# EasyEDA Pro project 通用采样.eprj

# Schematic NSM2015
Board Name: NSM2015; Create Date: 2025-08-12; Page Name: NSM2015; Project Name: 通用采样; Schematic Name: NSM2015; Update Date: 2025-08-15; Company: 嘉立创EDA; Page Size: A4; Version: V1.0
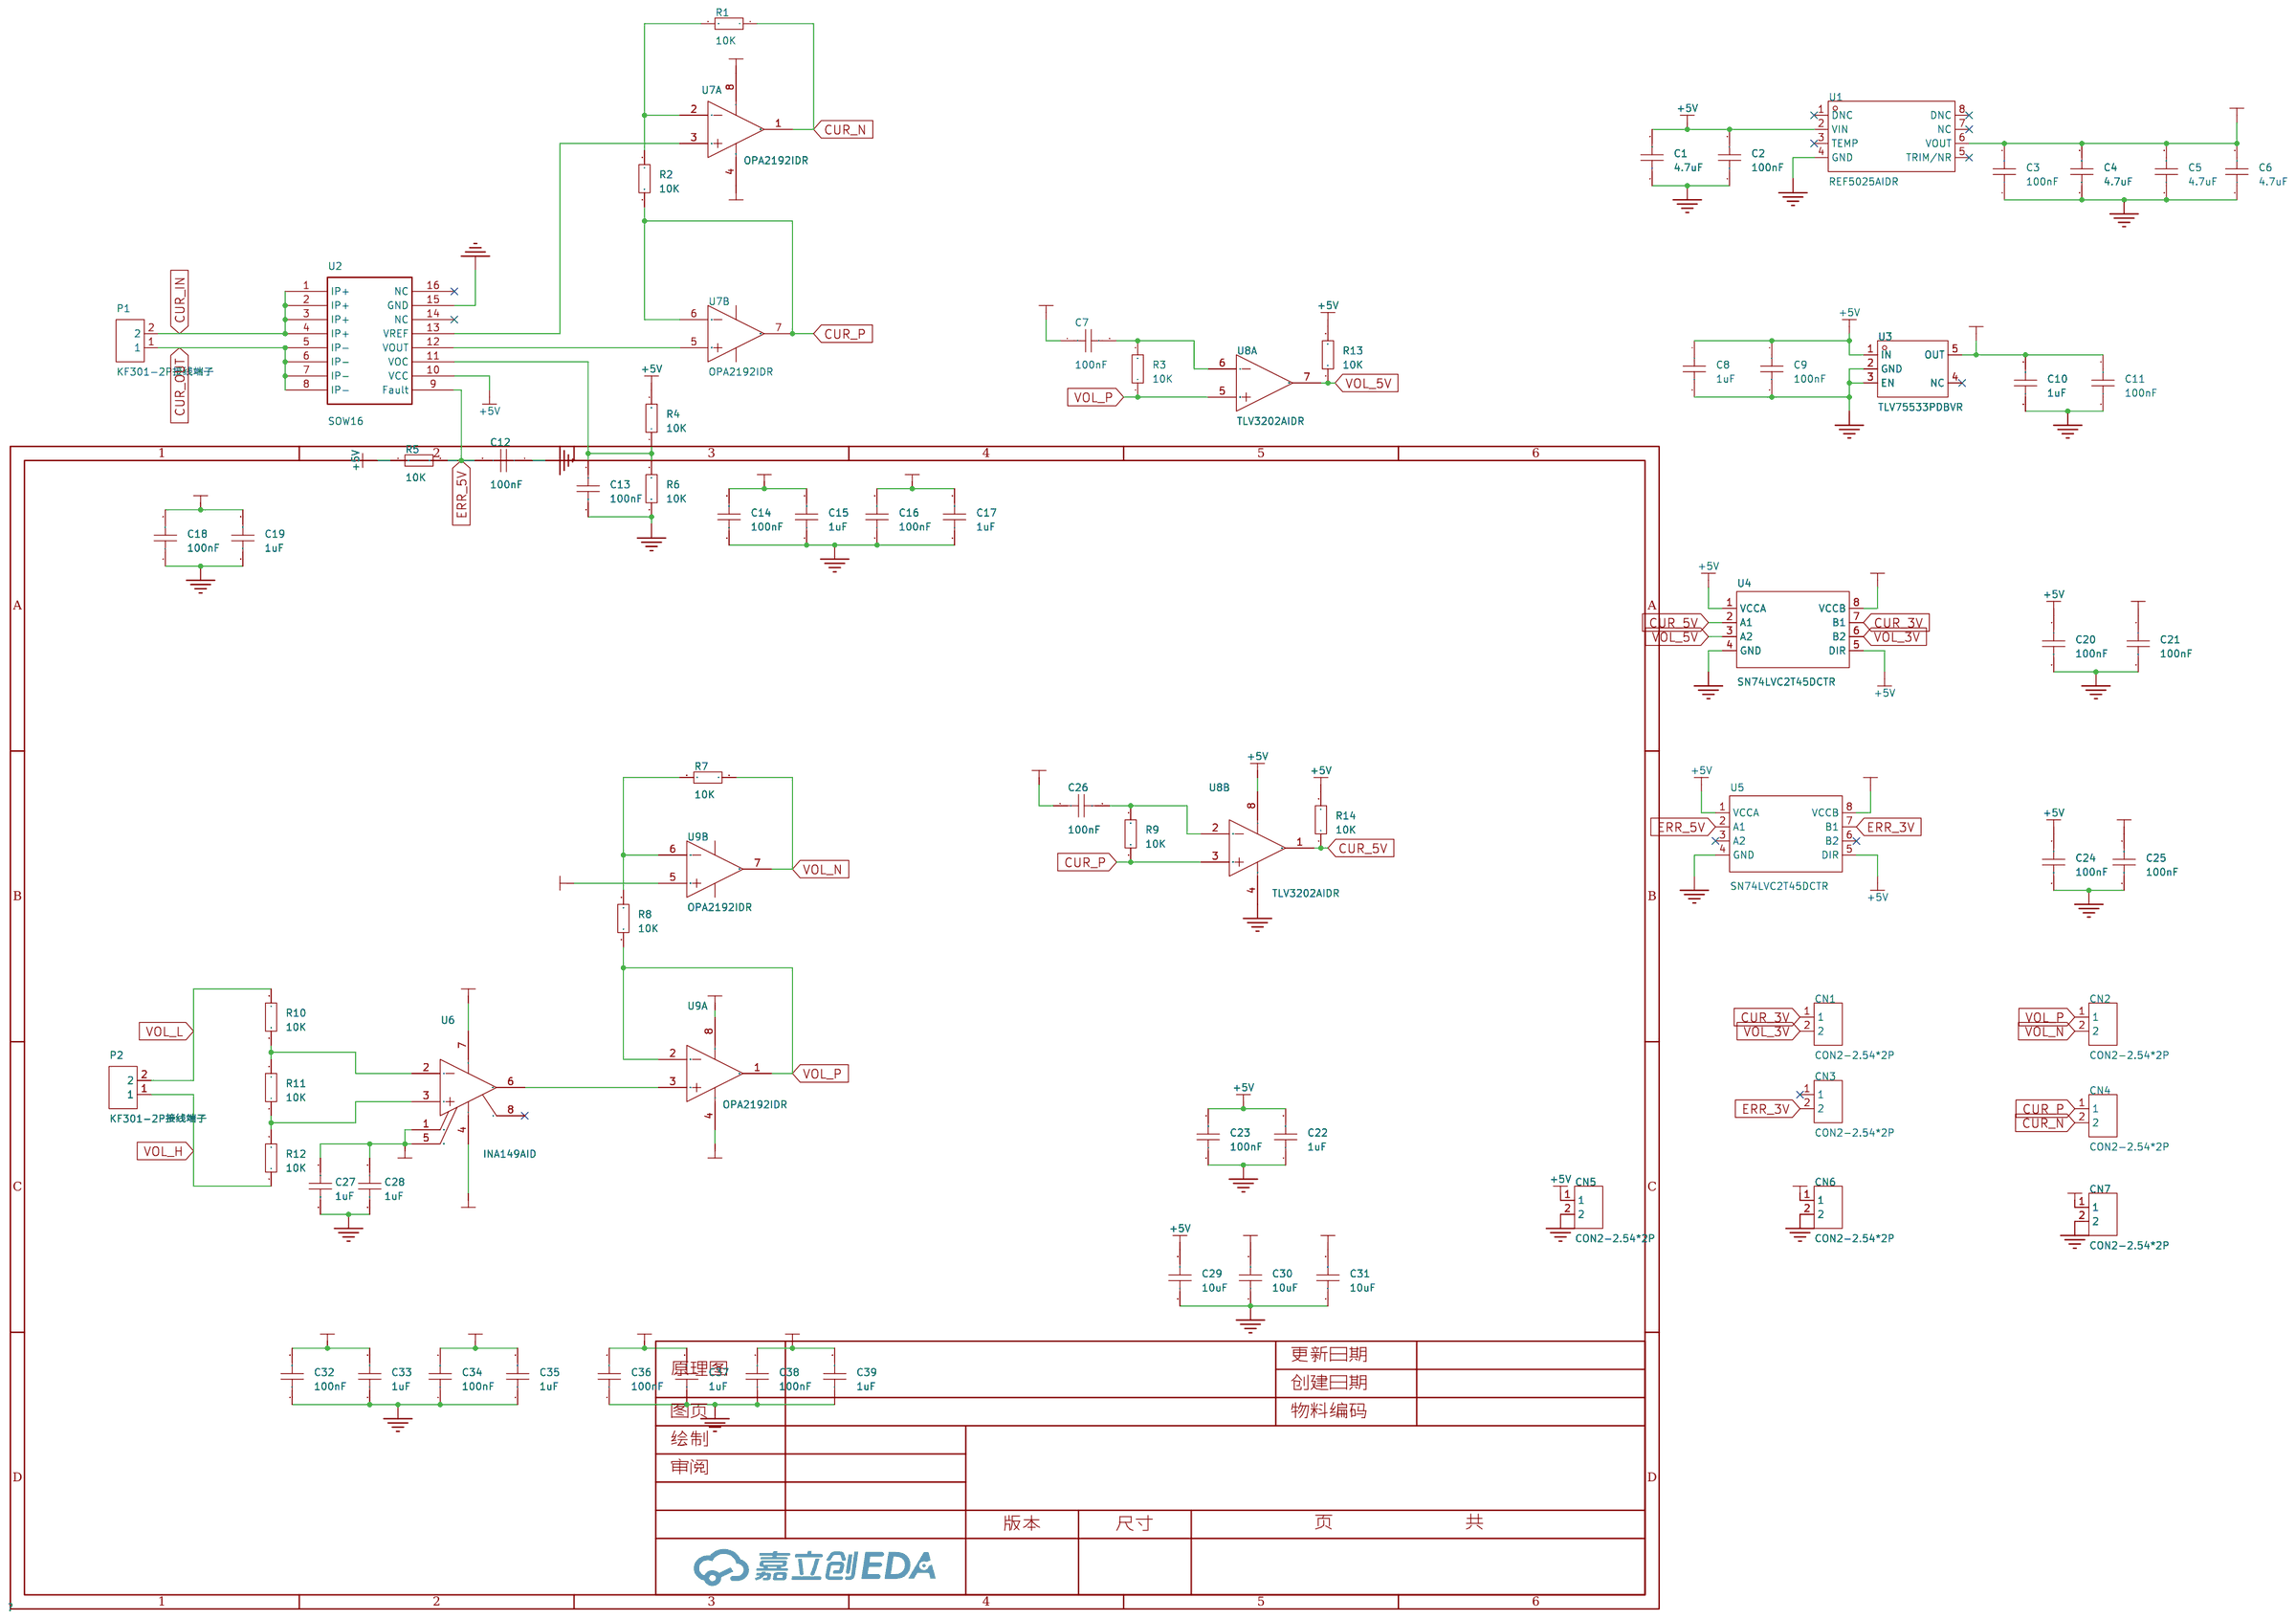
[diagram p0: schematic sheet]

## Parts
C1  4.7uF  [C0805]
C2  100nF  [C0805]
C3  100nF  [C0805]
C4  4.7uF  [C0805]
C5  4.7uF  [C0805]
C6  4.7uF  [C0805]
C7  100nF  [C0805]
C8  1uF  [C0805]
C9  100nF  [C0805]
C10  1uF  [C0805]
C11  100nF  [C0805]
C12  100nF  [C0805]
C13  100nF  [C0805]
C14  100nF  [C0805]
C15  1uF  [C0805]
C16  100nF  [C0805]
C17  1uF  [C0805]
C18  100nF  [C0805]
C19  1uF  [C0805]
C20  100nF  [C0805]
C21  100nF  [C0805]
C22  1uF  [C0805]
C23  100nF  [C0805]
C24  100nF  [C0805]
C25  100nF  [C0805]
C26  100nF  [C0805]
C27  1uF  [C0805]
C28  1uF  [C0805]
C29  10uF  [C0805]
C30  10uF  [C0805]
C31  10uF  [C0805]
C32  100nF  [C0805]
C33  1uF  [C0805]
C34  100nF  [C0805]
C35  1uF  [C0805]
C36  100nF  [C0805]
C37  1uF  [C0805]
C38  100nF  [C0805]
C39  1uF  [C0805]
CN1  CON2-2.54*2P  [CONN-TH_2P-P2.54-V]
CN2  CON2-2.54*2P  [CONN-TH_2P-P2.54-V]
CN3  CON2-2.54*2P  [CONN-TH_2P-P2.54-V]
CN4  CON2-2.54*2P  [CONN-TH_2P-P2.54-V]
CN5  CON2-2.54*2P  [CONN-TH_2P-P2.54-V]
CN6  CON2-2.54*2P  [CONN-TH_2P-P2.54-V]
CN7  CON2-2.54*2P  [CONN-TH_2P-P2.54-V]
P1  KF301-2P接线端子  [CONN-TH_XY301V-A-5.0-2P]
P2  KF301-2P接线端子  [CONN-TH_XY301V-A-5.0-2P]
R1  10K  [R0805]
R2  10K  [R0805]
R3  10K  [R0805]
R4  10K  [R0805]
R5  10K  [R0805]
R6  10K  [R0805]
R7  10K  [R0805]
R8  10K  [R0805]
R9  10K  [R0805]
R10  10K  [R0805]
R11  10K  [R0805]
R12  10K  [R0805]
R13  10K  [R0805]
R14  10K  [R0805]
U1  REF5025AIDR  [SOIC-8_L4.9-W3.9-P1.27-LS6.0-BL]
U2  SOW16  [NSM2015]
U3  TLV75533PDBVR  [SOT-23-5_L3.0-W1.7-P0.95-LS2.8-BR]
U4  SN74LVC2T45DCTR  [SM8_L3.2-W2.9-P0.65-LS4.3-BR]
U5  SN74LVC2T45DCTR  [SM8_L3.2-W2.9-P0.65-LS4.3-BR]
U6  INA149AID  [SOIC-8_L4.9-W3.9-P1.27-LS6.0-BL]
U7  OPA2192IDR  [SOIC-8_L4.9-W3.9-P1.27-LS6.0-BL]  (sections 1,2)
U8  TLV3202AIDR  [SOIC-8_L4.9-W3.9-P1.27-LS6.0-BL]  (sections 1,2)
U9  OPA2192IDR  [SOIC-8_L4.9-W3.9-P1.27-LS6.0-BL]  (sections 1,2)

## Library data of the parts
C1-C39 = CAP_0805: Supplier Footprint: 0805
CN1-CN7 = CON2-2.54*2P: Supplier Part: C9900003238; Supplier Footprint: TH-2P; JLCPCB Part Class: Extended Part; Supplier: LCSC
P1 P2 = KF301-2P接线端子: Supplier Part: C9900016950; Supplier Footprint: CK301-2P; JLCPCB Part Class: Extended Part; Supplier: LCSC
R1-R14 = Res_0805: Supplier Footprint: 0805
U1 = REF5025AIDR: Supplier Part: C11341; Manufacturer: TI(德州仪器); Supplier Footprint: SOIC-8; JLCPCB Part Class: 扩展库; Datasheet: https://www.ti.com/cn/lit/gpn/ref5025; Supplier: LCSC; Output Type: 固定; Voltage - Supply: 2.7V~18V; Output Voltage: 2.5V; Output Current: 10mA; Tolerance: ±0.1%; Temperature Coefficient: 8ppm/℃; Reference Type: 串联; Quiescent Current: 1.2mA; Noise - 1/10Hz to 10Hz: 3uVp-p; Operating Temperature: -40℃~+125℃@(Ta)
U2 = NSM2015
U3 = TLV75533PDBVR: 输出类型:固定;最大输入电压:5.5V;输出电压:3.3V;输出电流:500mA;电源纹波抑制比(PSRR):52dB;输出极性:正极;; LCSC Part Name: 具有使能功能的 500mA、高 PSRR、低 IQ、低压降稳压器; Supplier Part: C404027; Manufacturer: TI(德州仪器); Supplier Footprint: SOT-23-5; JLCPCB Part Class: 扩展库; Datasheet: https://www.ti.com/cn/lit/gpn/tlv755p; Supplier: LCSC; Output Type: 固定; Maximum Input Voltage: 5.5V; Output Voltage: 3.3V; Output Current: 500mA; Power Supply Rejection Ratio (PSRR): 52dB; Dropout Voltage: 238mV@(500mA); standby current: 31uA; Feature: 防静电保护；浪涌保护；低ESR；热保护(TSD)；欠压闭锁；过流保护(OCP)；带使能; Operating Temperature: -40℃~+125℃@(Tj); Output Polarity: 正极; Number of Outputs: 1
U4 U5 = SN74LVC2T45DCTR: Supplier Part: C22672; Manufacturer: TI(德州仪器); Supplier Footprint: SM8; JLCPCB Part Class: 扩展库; Datasheet: https://www.ti.com/cn/lit/gpn/sn74lvc2t45; Supplier: LCSC; Channel Type: 双向; Data Rate: 420Mbps; Voltage - Supply(VCCA): 1.65V~5.5V; Voltage - Supply(VCCB): 1.65V~5.5V; Number of Circuits: 2; Output Type: 三态; Operating Temperature: -40℃~+85℃
U6 = INA149AID: 放大器数:单路;输入偏置电流(Ib):-;输入失调电压(Vos):350uV;增益带宽积(GBP):-;压摆率(SR):5V/us;带宽(-3db):500kHz;; Supplier Part: C1346122; Manufacturer: TI(德州仪器); Supplier Footprint: SOIC-8; JLCPCB Part Class: 扩展库; Datasheet: https://www.ti.com/cn/lit/gpn/ina149; Supplier: LCSC; Number of Circuits: 单路; Voltage - Input Offset(Vos): 350uV; Slew Rate(SR): 5V/us; -3db Bandwidth: 500kHz; Operating Temperature: -40℃~+125℃
U7 U9 = OPA2192IDR: 放大器数:双路;增益带宽积(GBP):10MHz;输入偏置电流(Ib):5pA;输入失调电压(Vos):-;压摆率(SR):20V/us;带宽(-3db):-;轨到轨:轨到轨输入输出;; Supplier Part: C110074; Manufacturer: TI(德州仪器); Supplier Footprint: SOIC-8; JLCPCB Part Class: 扩展库; Datasheet: https://www.ti.com/cn/lit/gpn/opa2192; Supplier: LCSC; Number of Circuits: 双路; Gain Bandwidth Product(GBP): 10MHz; Current - Input Bias(Ib): 5pA; Slew Rate(SR): 20V/us; Output Current: 65mA; Rail to Rail: 轨到轨输入输出; Supply Current: 1mA; Operating Temperature: -40℃~+125℃
U8 = TLV3202AIDR: LCSC Part Name: 40纳秒响应时间，低功耗，推挽输出比较器; Supplier Part: C129325; Manufacturer: TI(德州仪器); Supplier Footprint: SOIC-8; JLCPCB Part Class: 扩展库; Datasheet: https://www.ti.com/cn/lit/gpn/tlv3201; Supplier: LCSC; Number of Channels: 双路; Vos - Input Offset Voltage: 1mV; Ib - Input Bias Current: 50pA; Propagation Delay Time: 40ns; Input Hysteresis Voltage (Vhys): 1.2mV; Voltage - Supply: 2.7V~5.5V; Output Type: CMOS; Rail to Rail: 轨到轨输入; Quiescent Current per Amplifier: 40uA; Operating Temperature: -40℃~+125℃

## Nets
3.3V: C10.1 C11.1 C21.1 C25.1 U3.5(OUT) U4.8(VCCB) U5.8(VCCB)
+2.5V: C3.2 C4.2 C5.2 C6.2 C7.1 C26.1 C27.1 C28.1 U1.6(VOUT) U6.1(REFB) U6.5(REFA) U9.5(VINB+)
+5V: C1.2 C2.2 C8.1 C9.1 C18.2 C19.2 C20.1 C22.2 C23.2 C24.1 C29.2 CN5.1 R4.2 R5.1 R13.2 R14.2 U1.2(VIN) U2.10(VCC) U3.1(IN) U4.1(VCCA) U4.5(DIR) U5.1(VCCA) U5.5(DIR) U8.8(VCC)
+12V: C14.2 C15.2 C30.2 C32.2 C33.2 C36.2 C37.2 CN6.1 U6.7(V+) U7.8(VDD) U9.8(VDD)
-12V: C16.2 C17.2 C31.2 C34.2 C35.2 C38.2 C39.2 CN7.1 U6.4(V-) U7.4(VSS) U9.4(VSS)
GND: C1.1 C2.1 C3.1 C4.1 C5.1 C6.1 C8.2 C9.2 C10.2 C11.2 C12.1 C13.2 C14.1 C15.1 C16.1 C17.1 C18.1 C19.1 C20.2 C21.2 C22.1 C23.1 C24.2 C25.2 C27.2 C28.2 C29.1 C30.1 C31.1 C32.1 C33.1 C34.1 C35.1 C36.1 C37.1 C38.1 C39.1 CN5.2 CN6.2 CN7.2 R6.1 U1.4(GND) U2.15(GND) U3.2(GND) U3.3(EN) U4.4(GND) U5.4(GND) U8.4(GND)
CUR_3V: CN1.1 U4.7(B1)
CUR_5V: R14.1 U4.2(A1) U8.1(OUT A)
CUR_IN: P1.2 U2.1(IP+) U2.2(IP+) U2.3(IP+) U2.4(IP+)
CUR_N: CN4.2 R1.1 U7.1(VOUTA)
CUR_OUT: P1.1 U2.5(IP-) U2.6(IP-) U2.7(IP-) U2.8(IP-)
CUR_P: CN4.1 R2.1 R9.1 U7.6(VINB-) U7.7(VOUTB) U8.3(+IN A)
ERR_3V: CN3.2 U5.7(B1)
ERR_5V: C12.2 R5.2 U2.9(Fault) U5.2(A1)
VOL_3V: CN1.2 U4.6(B2)
VOL_5V: R13.1 U4.3(A2) U8.7(OUT B)
VOL_H: P2.1 R12.1
VOL_L: P2.2 R10.2
VOL_N: CN2.2 R7.1 U9.7(VOUTB)
VOL_P: CN2.1 R3.1 R8.1 U8.5(+IN B) U9.1(VOUTA) U9.2(VINA-)
$1N2376: R10.1 R11.2 U6.2(-IN)
$1N2394: R11.1 R12.2 U6.3(+IN)
$1N2836: U6.6(VOUT) U9.3(VINA+)
$1N2969: R7.2 R8.2 U9.6(VINB-)
$1N3236: U2.12(VOUT) U7.5(VINB+)
$1N3246: R1.2 R2.2 U7.2(VINA-)
$1N3251: U2.13(VREF) U7.3(VINA+)
$1N4341: C7.2 R3.2 U8.6(-IN B)
$1N4495: C26.2 R9.2 U8.2(-IN A)
$1N6348: C13.1 R4.1 R6.2 U2.11(VOC)

Not connected (* = marked no-connect by the designer): CN3 1*; U1 1(DNC)* 3(TEMP)* 5(TRIM/NR)* 7(NC)* 8(DNC)*; U2 14(NC)* 16(NC)*; U3 4(NC)*; U5 3(A2)* 6(B2)*; U6 8(NC)*

# Schematic CKSR15
Board Name: CKSR15; Create Date: 2025-08-14; Page Name: P1; Project Name: 通用采样; Schematic Name: CKSR15; Update Date: 2025-08-14; Company: 嘉立创EDA; Page Size: A4; Version: V1.0
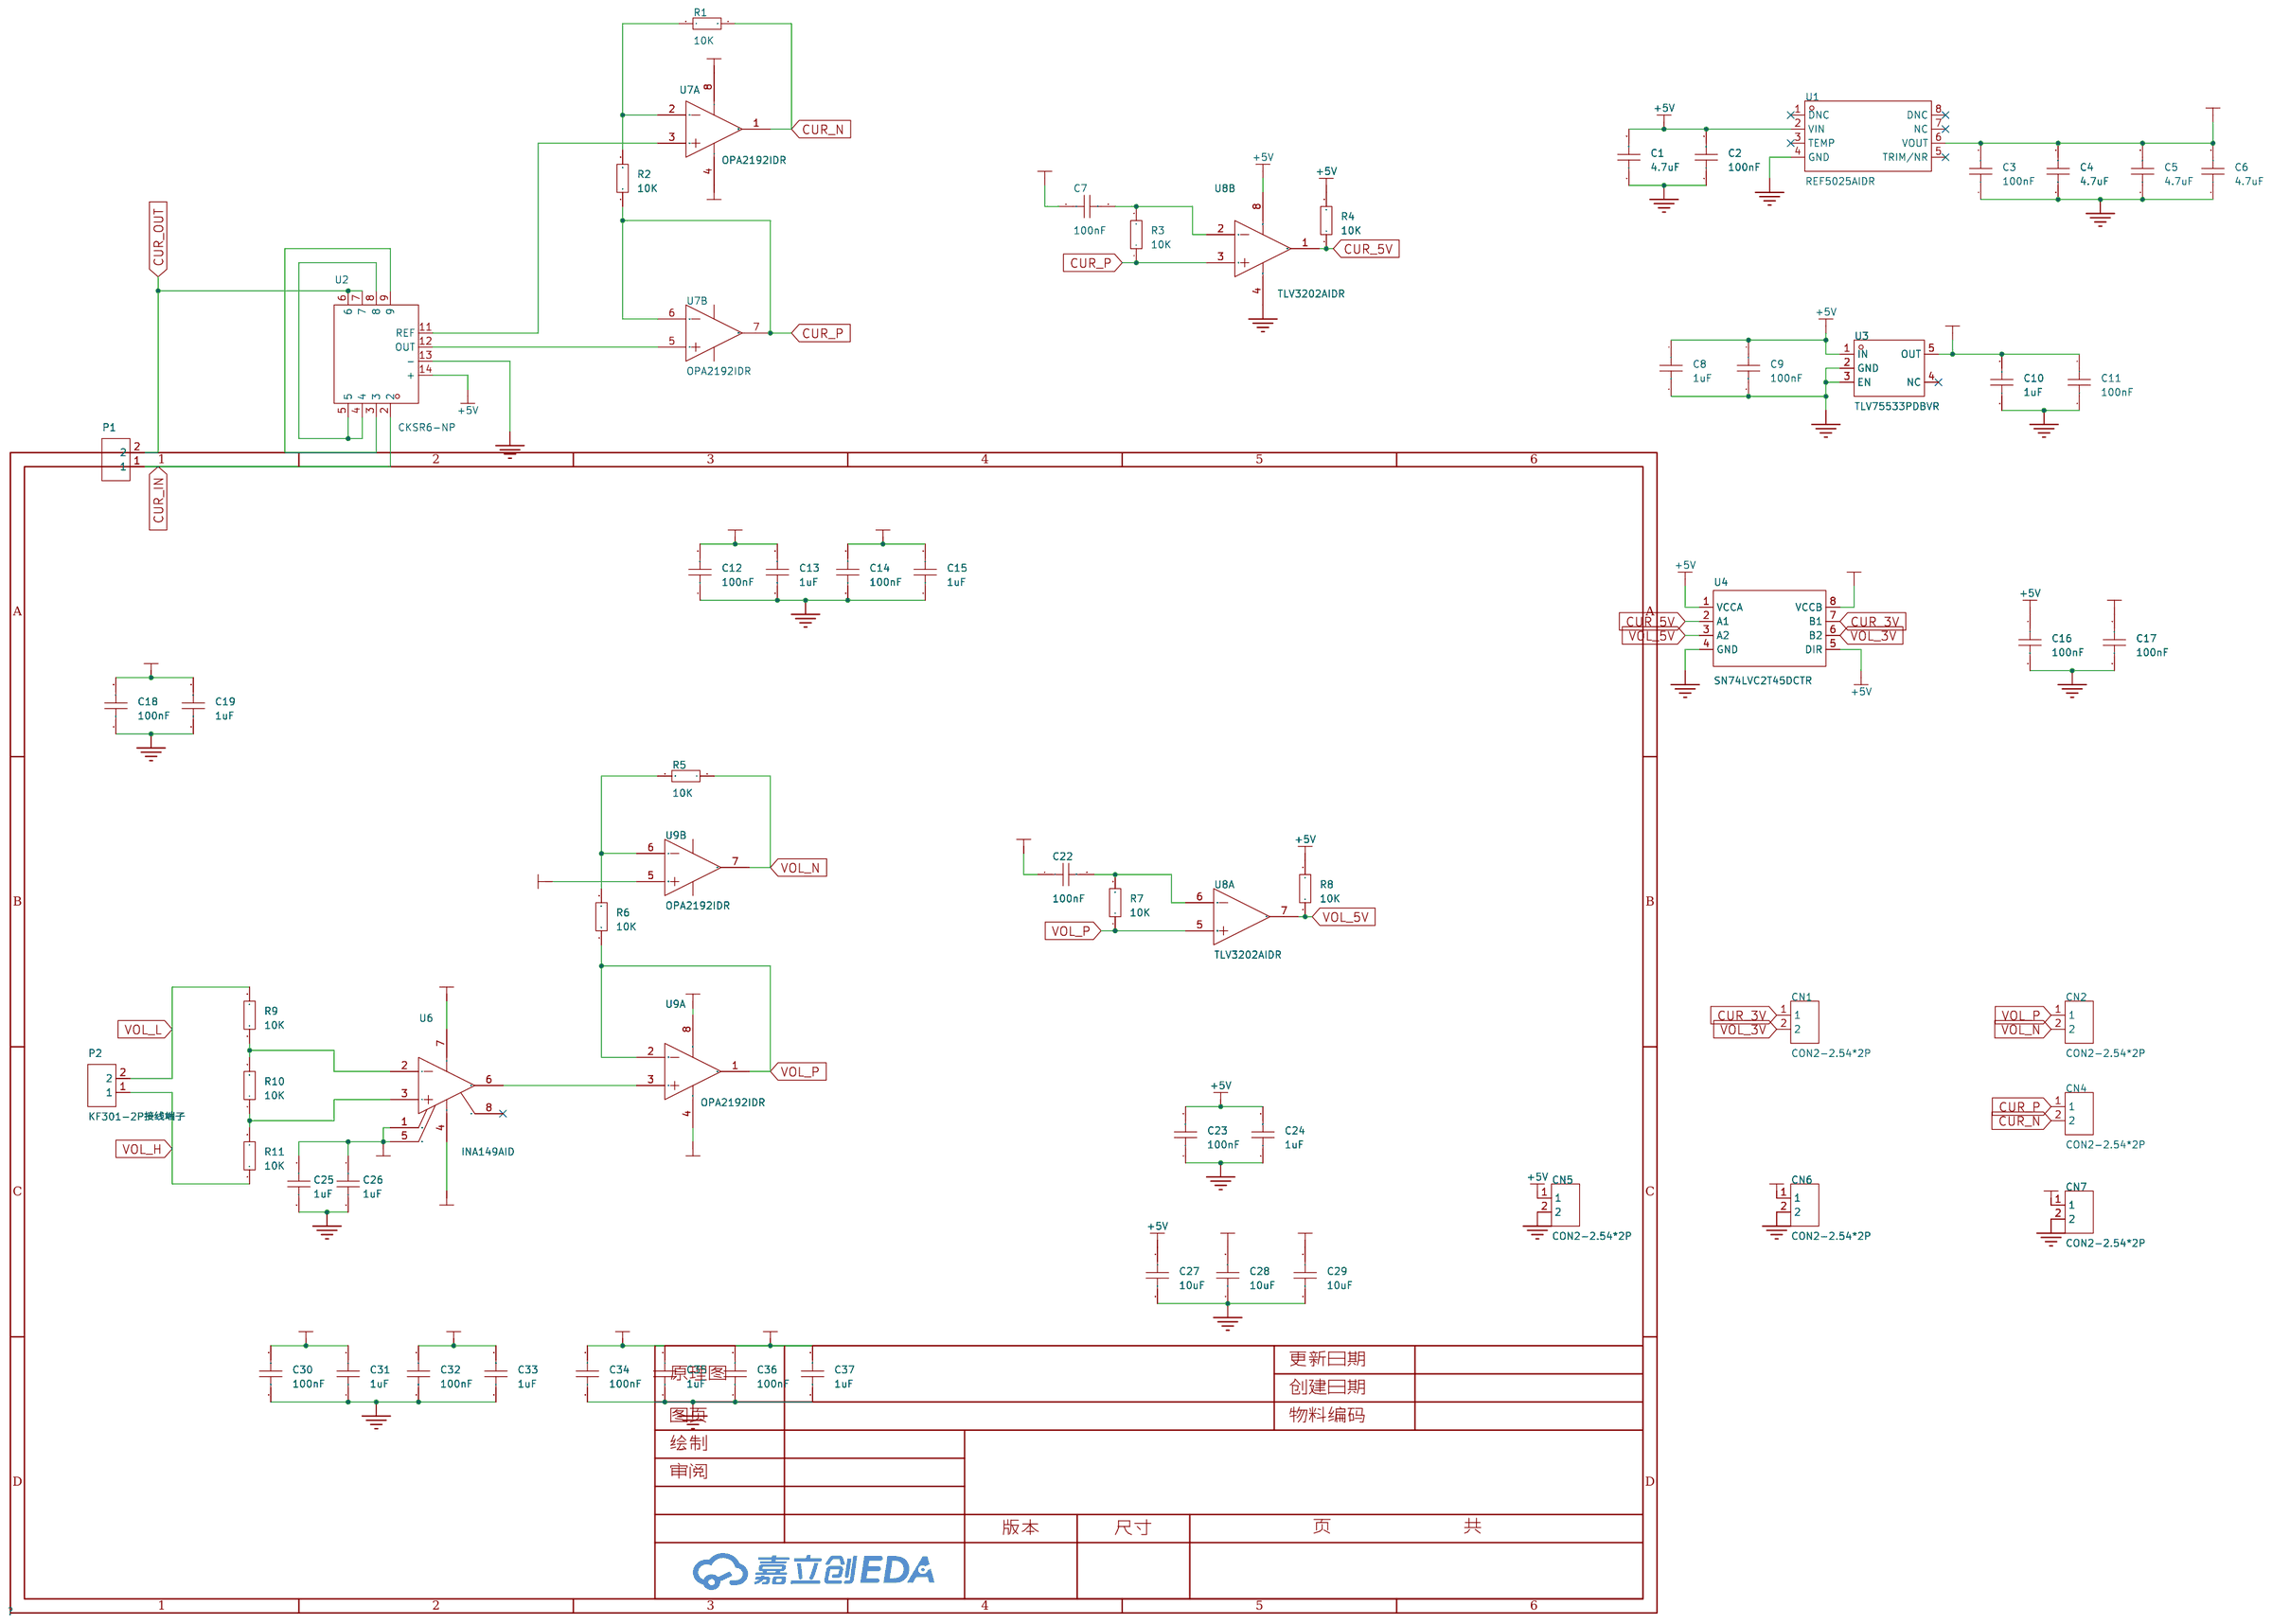
[diagram p1: schematic sheet]

## Parts
C1  4.7uF  [C0805]
C2  100nF  [C0805]
C3  100nF  [C0805]
C4  4.7uF  [C0805]
C5  4.7uF  [C0805]
C6  4.7uF  [C0805]
C7  100nF  [C0805]
C8  1uF  [C0805]
C9  100nF  [C0805]
C10  1uF  [C0805]
C11  100nF  [C0805]
C12  100nF  [C0805]
C13  1uF  [C0805]
C14  100nF  [C0805]
C15  1uF  [C0805]
C16  100nF  [C0805]
C17  100nF  [C0805]
C18  100nF  [C0805]
C19  1uF  [C0805]
C22  100nF  [C0805]
C23  100nF  [C0805]
C24  1uF  [C0805]
C25  1uF  [C0805]
C26  1uF  [C0805]
C27  10uF  [C0805]
C28  10uF  [C0805]
C29  10uF  [C0805]
C30  100nF  [C0805]
C31  1uF  [C0805]
C32  100nF  [C0805]
C33  1uF  [C0805]
C34  100nF  [C0805]
C35  1uF  [C0805]
C36  100nF  [C0805]
C37  1uF  [C0805]
CN1  CON2-2.54*2P  [CONN-TH_2P-P2.54-V]
CN2  CON2-2.54*2P  [CONN-TH_2P-P2.54-V]
CN4  CON2-2.54*2P  [CONN-TH_2P-P2.54-V]
CN5  CON2-2.54*2P  [CONN-TH_2P-P2.54-V]
CN6  CON2-2.54*2P  [CONN-TH_2P-P2.54-V]
CN7  CON2-2.54*2P  [CONN-TH_2P-P2.54-V]
P1  KF301-2P接线端子  [CONN-TH_XY301V-A-5.0-2P]
P2  KF301-2P接线端子  [CONN-TH_XY301V-A-5.0-2P]
R1  10K  [R0805]
R2  10K  [R0805]
R3  10K  [R0805]
R4  10K  [R0805]
R5  10K  [R0805]
R6  10K  [R0805]
R7  10K  [R0805]
R8  10K  [R0805]
R9  10K  [R0805]
R10  10K  [R0805]
R11  10K  [R0805]
U1  REF5025AIDR  [SOIC-8_L4.9-W3.9-P1.27-LS6.0-BL]
U2  CKSR6-NP  [SENSOR-TH_CKSR6-NP]
U3  TLV75533PDBVR  [SOT-23-5_L3.0-W1.7-P0.95-LS2.8-BR]
U4  SN74LVC2T45DCTR  [SM8_L3.2-W2.9-P0.65-LS4.3-BR]
U6  INA149AID  [SOIC-8_L4.9-W3.9-P1.27-LS6.0-BL]
U7  OPA2192IDR  [SOIC-8_L4.9-W3.9-P1.27-LS6.0-BL]  (sections 1,2)
U8  TLV3202AIDR  [SOIC-8_L4.9-W3.9-P1.27-LS6.0-BL]  (sections 1,2)
U9  OPA2192IDR  [SOIC-8_L4.9-W3.9-P1.27-LS6.0-BL]  (sections 1,2)

## Library data of the parts
C1-C19 C22-C37 = CAP_0805: Supplier Footprint: 0805
CN1 CN2 CN4-CN7 = CON2-2.54*2P: Supplier Part: C9900003238; Supplier Footprint: TH-2P; JLCPCB Part Class: Extended Part; Supplier: LCSC
P1 P2 = KF301-2P接线端子: Supplier Part: C9900016950; Supplier Footprint: CK301-2P; JLCPCB Part Class: Extended Part; Supplier: LCSC
R1-R11 = Res_0805: Supplier Footprint: 0805
U1 = REF5025AIDR: Supplier Part: C11341; Manufacturer: TI(德州仪器); Supplier Footprint: SOIC-8; JLCPCB Part Class: 扩展库; Datasheet: https://www.ti.com/cn/lit/gpn/ref5025; Supplier: LCSC; Output Type: 固定; Voltage - Supply: 2.7V~18V; Output Voltage: 2.5V; Output Current: 10mA; Tolerance: ±0.1%; Temperature Coefficient: 8ppm/℃; Reference Type: 串联; Quiescent Current: 1.2mA; Noise - 1/10Hz to 10Hz: 3uVp-p; Operating Temperature: -40℃~+125℃@(Ta)
U2 = CKSR6-NP: Supplier Part: C454684; Manufacturer: LEM(莱姆); Supplier Footprint: 插件; JLCPCB Part Class: 扩展库; Datasheet: https://item.szlcsc.com/datasheet/CKSR6-NP/456994.html; Supplier: LCSC
U3 = TLV75533PDBVR: 输出类型:固定;最大输入电压:5.5V;输出电压:3.3V;输出电流:500mA;电源纹波抑制比(PSRR):52dB;输出极性:正极;; LCSC Part Name: 具有使能功能的 500mA、高 PSRR、低 IQ、低压降稳压器; Supplier Part: C404027; Manufacturer: TI(德州仪器); Supplier Footprint: SOT-23-5; JLCPCB Part Class: 扩展库; Datasheet: https://www.ti.com/cn/lit/gpn/tlv755p; Supplier: LCSC; Output Type: 固定; Maximum Input Voltage: 5.5V; Output Voltage: 3.3V; Output Current: 500mA; Power Supply Rejection Ratio (PSRR): 52dB; Dropout Voltage: 238mV@(500mA); standby current: 31uA; Feature: 防静电保护；浪涌保护；低ESR；热保护(TSD)；欠压闭锁；过流保护(OCP)；带使能; Operating Temperature: -40℃~+125℃@(Tj); Output Polarity: 正极; Number of Outputs: 1
U4 = SN74LVC2T45DCTR: Supplier Part: C22672; Manufacturer: TI(德州仪器); Supplier Footprint: SM8; JLCPCB Part Class: 扩展库; Datasheet: https://www.ti.com/cn/lit/gpn/sn74lvc2t45; Supplier: LCSC; Channel Type: 双向; Data Rate: 420Mbps; Voltage - Supply(VCCA): 1.65V~5.5V; Voltage - Supply(VCCB): 1.65V~5.5V; Number of Circuits: 2; Output Type: 三态; Operating Temperature: -40℃~+85℃
U6 = INA149AID: 放大器数:单路;输入偏置电流(Ib):-;输入失调电压(Vos):350uV;增益带宽积(GBP):-;压摆率(SR):5V/us;带宽(-3db):500kHz;; Supplier Part: C1346122; Manufacturer: TI(德州仪器); Supplier Footprint: SOIC-8; JLCPCB Part Class: 扩展库; Datasheet: https://www.ti.com/cn/lit/gpn/ina149; Supplier: LCSC; Number of Circuits: 单路; Voltage - Input Offset(Vos): 350uV; Slew Rate(SR): 5V/us; -3db Bandwidth: 500kHz; Operating Temperature: -40℃~+125℃
U7 U9 = OPA2192IDR: 放大器数:双路;增益带宽积(GBP):10MHz;输入偏置电流(Ib):5pA;输入失调电压(Vos):-;压摆率(SR):20V/us;带宽(-3db):-;轨到轨:轨到轨输入输出;; Supplier Part: C110074; Manufacturer: TI(德州仪器); Supplier Footprint: SOIC-8; JLCPCB Part Class: 扩展库; Datasheet: https://www.ti.com/cn/lit/gpn/opa2192; Supplier: LCSC; Number of Circuits: 双路; Gain Bandwidth Product(GBP): 10MHz; Current - Input Bias(Ib): 5pA; Slew Rate(SR): 20V/us; Output Current: 65mA; Rail to Rail: 轨到轨输入输出; Supply Current: 1mA; Operating Temperature: -40℃~+125℃
U8 = TLV3202AIDR: LCSC Part Name: 40纳秒响应时间，低功耗，推挽输出比较器; Supplier Part: C129325; Manufacturer: TI(德州仪器); Supplier Footprint: SOIC-8; JLCPCB Part Class: 扩展库; Datasheet: https://www.ti.com/cn/lit/gpn/tlv3201; Supplier: LCSC; Number of Channels: 双路; Vos - Input Offset Voltage: 1mV; Ib - Input Bias Current: 50pA; Propagation Delay Time: 40ns; Input Hysteresis Voltage (Vhys): 1.2mV; Voltage - Supply: 2.7V~5.5V; Output Type: CMOS; Rail to Rail: 轨到轨输入; Quiescent Current per Amplifier: 40uA; Operating Temperature: -40℃~+125℃

## Nets
3.3V: C10.1 C11.1 C17.1 U3.5(OUT) U4.8(VCCB)
+2.5V: C3.2 C4.2 C5.2 C6.2 C7.1 C22.1 C25.1 C26.1 U1.6(VOUT) U6.1(REFB) U6.5(REFA) U9.5(VINB+)
+5V: C1.2 C2.2 C8.1 C9.1 C16.1 C18.2 C19.2 C23.2 C24.2 C27.2 CN5.1 R4.2 R8.2 U1.2(VIN) U2.14(+) U3.1(IN) U4.1(VCCA) U4.5(DIR) U8.8(VCC)
+12V: C12.2 C13.2 C28.2 C30.2 C31.2 C34.2 C35.2 CN6.1 U6.7(V+) U7.8(VDD) U9.8(VDD)
-12V: C14.2 C15.2 C29.2 C32.2 C33.2 C36.2 C37.2 CN7.1 U6.4(V-) U7.4(VSS) U9.4(VSS)
GND: C1.1 C2.1 C3.1 C4.1 C5.1 C6.1 C8.2 C9.2 C10.2 C11.2 C12.1 C13.1 C14.1 C15.1 C16.2 C17.2 C18.1 C19.1 C23.1 C24.1 C25.2 C26.2 C27.1 C28.1 C29.1 C30.1 C31.1 C32.1 C33.1 C34.1 C35.1 C36.1 C37.1 CN5.2 CN6.2 CN7.2 U1.4(GND) U2.13(-) U3.2(GND) U3.3(EN) U4.4(GND) U8.4(GND)
CUR_3V: CN1.1 U4.7(B1)
CUR_5V: R4.1 U4.2(A1) U8.1(OUT A)
CUR_IN: P1.1 U2.2
CUR_N: CN4.2 R1.1 U7.1(VOUTA)
CUR_OUT: P1.2 U2.6 U2.7
CUR_P: CN4.1 R2.1 R3.1 U7.6(VINB-) U7.7(VOUTB) U8.3(+IN A)
VOL_3V: CN1.2 U4.6(B2)
VOL_5V: R8.1 U4.3(A2) U8.7(OUT B)
VOL_H: P2.1 R11.1
VOL_L: P2.2 R9.2
VOL_N: CN2.2 R5.1 U9.7(VOUTB)
VOL_P: CN2.1 R6.1 R7.1 U8.5(+IN B) U9.1(VOUTA) U9.2(VINA-)
$1N3362: R9.1 R10.2 U6.2(-IN)
$1N3363: R10.1 R11.2 U6.3(+IN)
$1N3370: U6.6(VOUT) U9.3(VINA+)
$1N3373: R5.2 R6.2 U9.6(VINB-)
$1N3378: U2.12(OUT) U7.5(VINB+)
$1N3381: R1.2 R2.2 U7.2(VINA-)
$1N3382: U2.11(REF) U7.3(VINA+)
$1N3389: C22.2 R7.2 U8.6(-IN B)
$1N3392: C7.2 R3.2 U8.2(-IN A)
$1N3695: U2.3 U2.9
$1N3709: U2.4 U2.5 U2.8

Not connected (* = marked no-connect by the designer): U1 1(DNC)* 3(TEMP)* 5(TRIM/NR)* 7(NC)* 8(DNC)*; U3 4(NC)*; U6 8(NC)*

# Board NSM2015
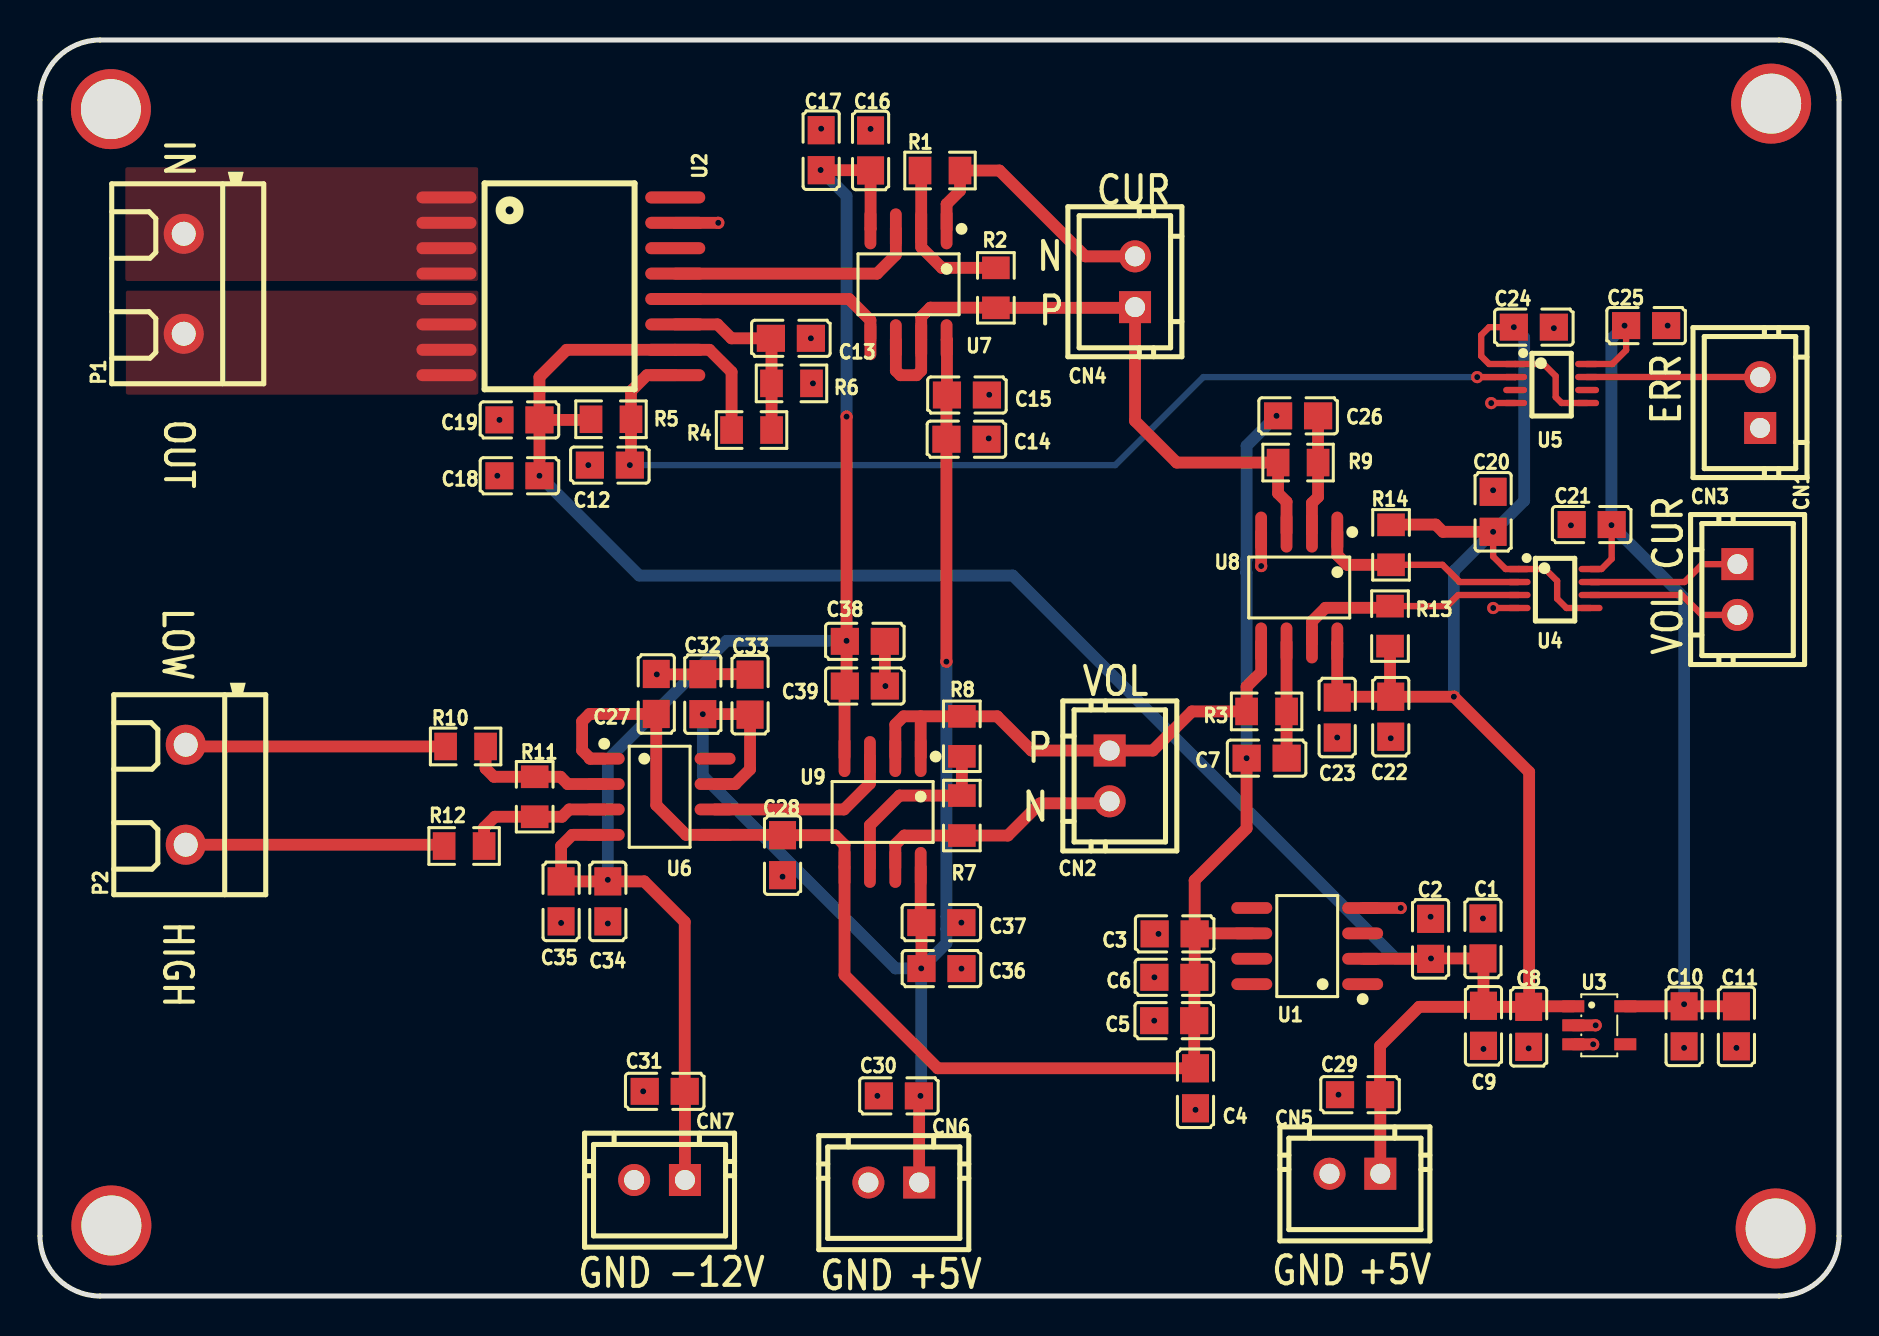
[diagram p2: board, top side]
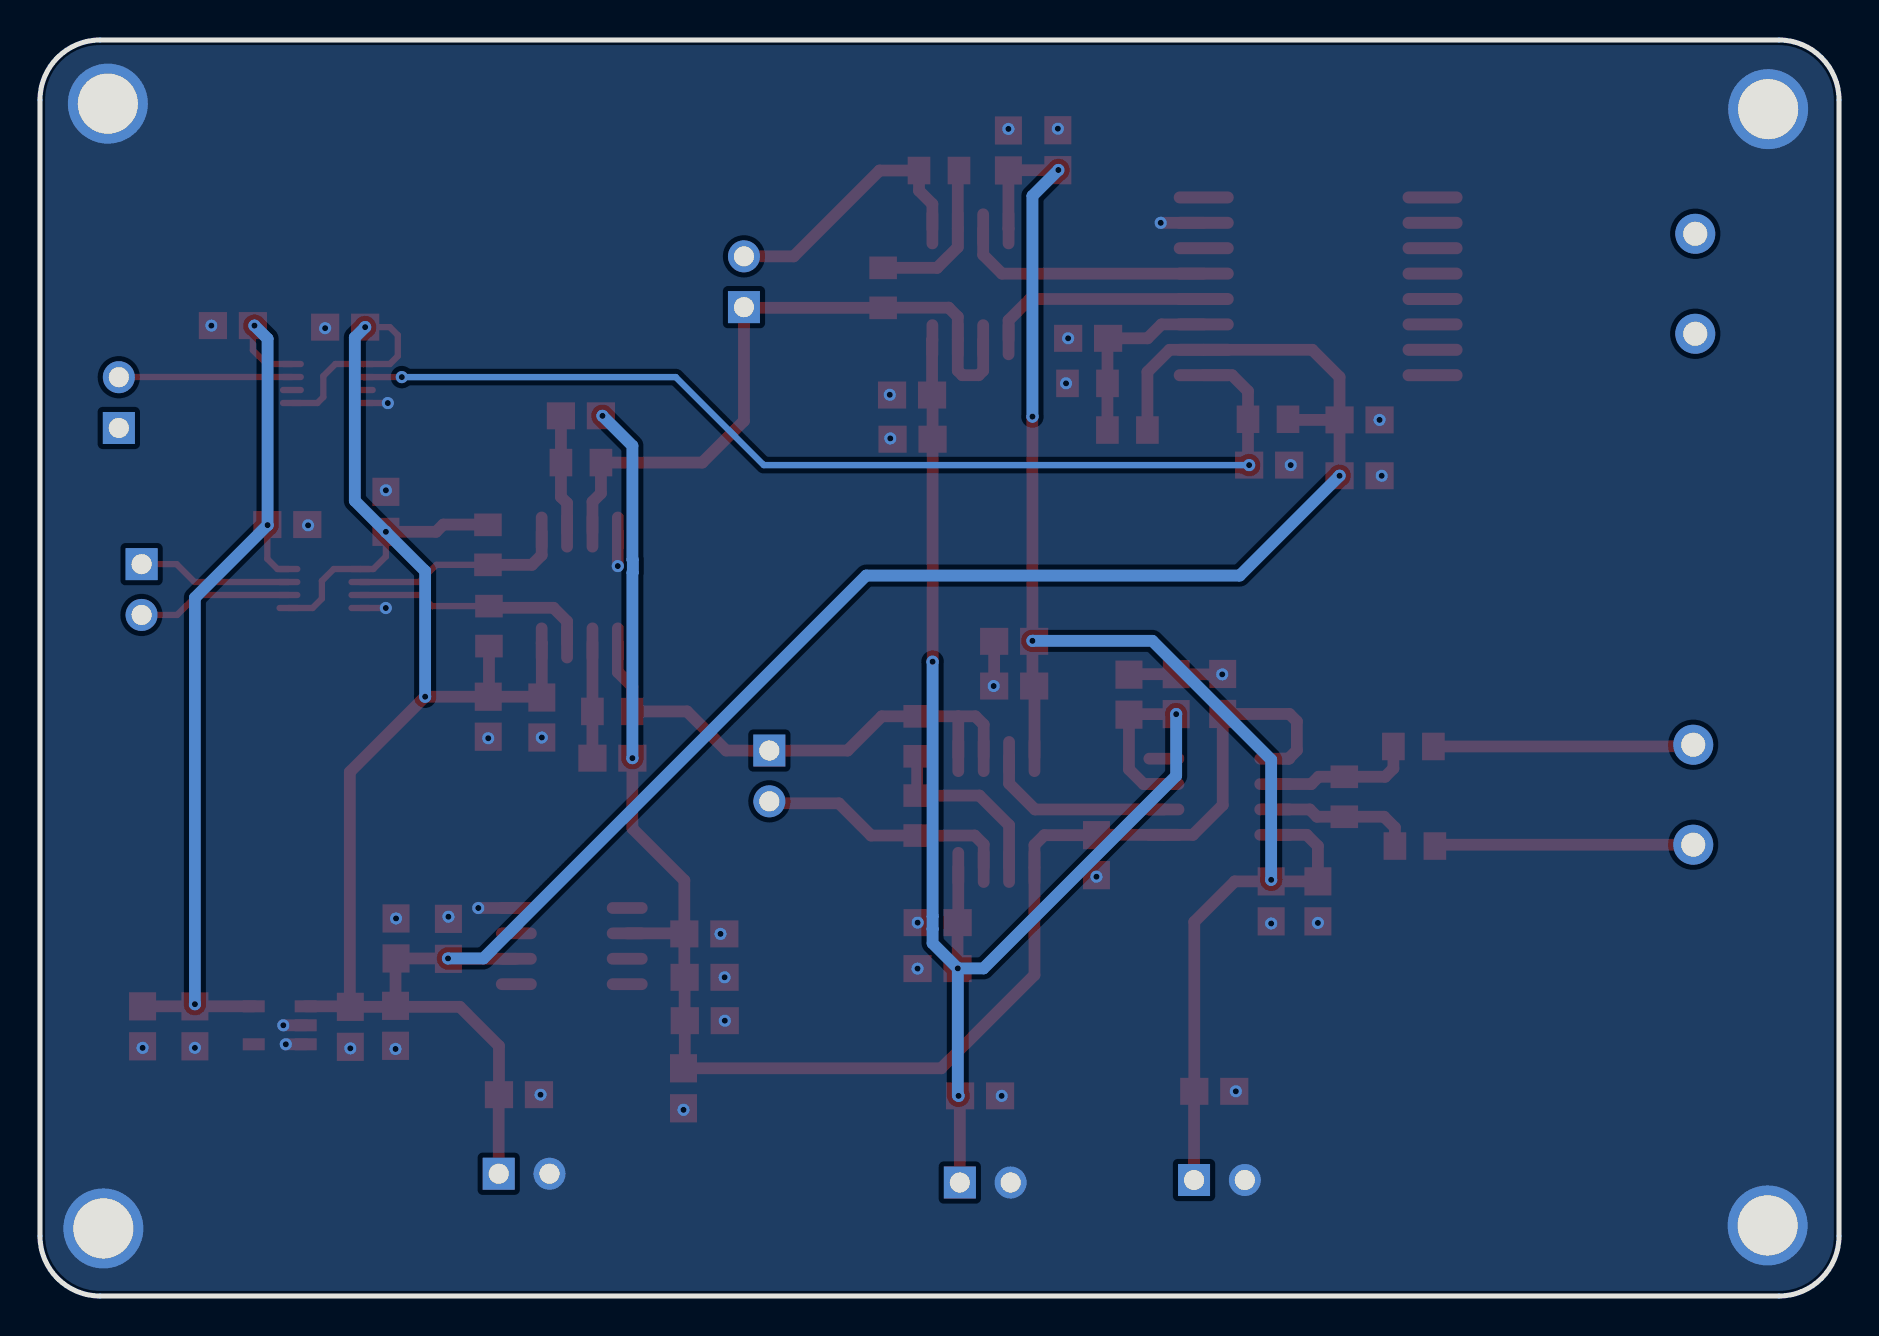
[diagram p3: board, bottom side, seen from below]

Outline 89.97 x 62.81 mm; copper layers: Top Layer, Bottom Layer. Coordinates in mm from the lower left corner of the outline.
Outline path: 0,59.81 0,3 arc(0.88,0.88) 3,0 86.97,0 arc(89.09,0.88) 89.97,3 89.97,59.81 arc(89.09,61.94) 86.97,62.81 3,62.81 arc(0.88,61.94) 0,59.81
Stack: Top Layer 0.035mm / Dielectric1 1.51mm FR4 er 4.5 / Bottom Layer 0.035mm

## Design rules (mm)
template: 自定义配置
spacing copperThickness1oz (default): track to track 0.102, other pairs 0.152 to 0.3
spacing copperThickness2oz: track to track 0.203, other pairs 0.152 to 0.3
track width copperThickness1oz (default): min 0.127, default 0.254, max 2.54
track width copperThickness2oz: min 0.203, default 0.254, max 2.54
differential pair differentialPair (default): width min 0.127, default 0.254, max 2.54; gap min 0.152, default 0.152
via viaSize (default): diameter min 0.5, default 0.61, max 10; hole min 0.3, default 0.305, max 6.3

## Placement (name value [footprint] x y rotation side)
C1  4.7uF  [C0805]  72.16 17.88 270 top
C2  100nF  [C0805]  69.54 17.86 270 top
C3  100nF  [C0805]  56.74 18.11 0 top
C4  4.7uF  [C0805]  57.78 10.39 90 top
C5  4.7uF  [C0805]  56.72 13.77 0 top
C6  4.7uF  [C0805]  56.73 15.94 0 top
C7  100nF  [C0805]  61.34 26.9 0 top
C8  1uF  [C0805]  74.45 13.46 270 top
C9  100nF  [C0805]  72.19 13.51 270 top
C10  1uF  [C0805]  82.22 13.49 270 top
C11  100nF  [C0805]  84.84 13.49 270 top
C12  100nF  [C0805]  28.5 41.55 0 top
C13  100nF  [C0805]  37.55 47.89 0 top
C14  100nF  [C0805]  46.33 42.85 180 top
C15  1uF  [C0805]  46.35 45.06 180 top
C16  100nF  [C0805]  41.54 57.29 270 top
C17  1uF  [C0805]  39.06 57.3 270 top
C18  100nF  [C0805]  23.98 41.02 0 top
C19  1uF  [C0805]  23.98 43.81 0 top
C20  100nF  [C0805]  72.67 39.22 90 top
C21  100nF  [C0805]  77.6 38.58 180 top
C22  1uF  [C0805]  67.55 28.97 90 top
C23  100nF  [C0805]  64.87 28.93 90 top
C24  100nF  [C0805]  74.71 48.45 0 top
C25  100nF  [C0805]  80.32 48.53 0 top
C26  100nF  [C0805]  62.92 44.02 0 top
C27  1uF  [C0805]  30.82 30.11 90 top
C28  1uF  [C0805]  37.13 22.05 270 top
C29  10uF  [C0805]  66.01 10.07 0 top
C30  10uF  [C0805]  42.95 10.01 0 top
C31  10uF  [C0805]  31.24 10.24 0 top
C32  100nF  [C0805]  33.15 30.1 270 top
C33  1uF  [C0805]  35.51 30.07 270 top
C34  100nF  [C0805]  28.4 19.74 90 top
C35  1uF  [C0805]  26.06 19.74 90 top
C36  100nF  [C0805]  45.08 16.37 180 top
C37  1uF  [C0805]  45.08 18.67 180 top
C38  100nF  [C0805]  41.25 32.74 180 top
C39  1uF  [C0805]  41.25 30.5 180 top
CN1  CON2-2.54*2P  [CONN-TH_2P-P2.54-V]  84.89 35.33 270 top
CN2  CON2-2.54*2P  [CONN-TH_2P-P2.54-V]  53.49 26.01 270 top
CN3  CON2-2.54*2P  [CONN-TH_2P-P2.54-V]  86.02 44.68 90 top
CN4  CON2-2.54*2P  [CONN-TH_2P-P2.54-V]  54.76 50.72 90 top
CN5  CON2-2.54*2P  [CONN-TH_2P-P2.54-V]  65.76 6.11 180 top
CN6  CON2-2.54*2P  [CONN-TH_2P-P2.54-V]  42.7 5.68 180 top
CN7  CON2-2.54*2P  [CONN-TH_2P-P2.54-V]  30.98 5.8 180 top
NOREF  -  [Pad_e1320]  86.8 3.38 0 top
NOREF#2  -  [Pad_e1321]  86.57 59.63 0 top
NOREF#3  -  [Pad_e1319]  3.57 3.53 0 top
NOREF#4  -  [Pad_e1317]  3.54 59.36 0 top
P1  KF301-2P接线端子  [CONN-TH_XY301V-A-5.0-2P]  7.19 50.62 90 top
P2  KF301-2P接线端子  [CONN-TH_XY301V-A-5.0-2P]  7.29 25.07 90 top
R1  10K  [R0805]  45.01 56.29 180 top
R2  10K  [R0805]  47.8 50.42 90 top
R3  10K  [R0805]  61.34 29.23 0 top
R4  10K  [R0805]  35.59 43.31 180 top
R5  10K  [R0805]  28.56 43.85 0 top
R6  10K  [R0805]  37.58 45.64 180 top
R7  10K  [R0805]  46.1 24.03 90 top
R8  10K  [R0805]  46.1 27.99 270 top
R9  10K  [R0805]  62.92 41.68 0 top
R10  10K  [R0805]  21.28 27.48 180 top
R11  10K  [R0805]  24.74 24.97 90 top
R12  10K  [R0805]  21.21 22.5 0 top
R13  10K  [R0805]  67.51 33.5 270 top
R14  10K  [R0805]  67.56 37.57 90 top
U1  REF5025AIDR  [SOIC-8_L4.9-W3.9-P1.27-LS6.0-BL]  63.37 17.5 90 top
U2  SOW16  [NSM2015]  25.98 50.49 270 top
U3  TLV75533PDBVR  [SOT-23-5_L3.0-W1.7-P0.95-LS2.8-BR]  77.98 13.54 180 top
U4  SN74LVC2T45DCTR  [SM8_L3.2-W2.9-P0.65-LS4.3-BR]  75.74 35.38 180 top
U5  SN74LVC2T45DCTR  [SM8_L3.2-W2.9-P0.65-LS4.3-BR]  75.57 45.63 180 top
U6  INA149AID  [SOIC-8_L4.9-W3.9-P1.27-LS6.0-BL]  30.99 24.97 270 top
U7  OPA2192IDR  [SOIC-8_L4.9-W3.9-P1.27-LS6.0-BL]  43.43 50.6 180 top
U8  TLV3202AIDR  [SOIC-8_L4.9-W3.9-P1.27-LS6.0-BL]  62.97 35.43 180 top
U9  OPA2192IDR  [SOIC-8_L4.9-W3.9-P1.27-LS6.0-BL]  42.14 24.21 180 top

## Footprints (pads in the part's own frame, mm; a bottom-side part is the same pattern mirrored in y, then rotated)
C0805
  rect 1.41x1.35 smd: 1(-1,0) 2(1,0)
CONN-TH_2P-P2.54-V
  rect 1.6x1.6 hole 1: 1(-1.27,0)
  round 1.6 hole 1: 2(1.27,0)
CONN-TH_XY301V-A-5.0-2P
  round 2 hole 1.2: 1(-2.5,0) 2(2.5,0)
NSM2015
  oval 0.6x3 smd: 1(-4.445,-5.658) 2(-3.175,-5.658) 3(-1.905,-5.658) 4(-0.635,-5.658) 5(0.635,-5.658) 6(1.905,-5.658) 7(3.175,-5.658) 8(4.445,-5.658) 9(4.445,5.785) 10(3.175,5.785) 11(1.905,5.785) 12(0.635,5.785) 13(-0.635,5.785) 14(-1.905,5.785) 15(-3.175,5.785) 16(-4.445,5.785)
Pad_e1317
  round 4 hole 3: 1(0,0)
Pad_e1319
  round 4 hole 3: 1(0,0)
Pad_e1320
  round 4 hole 3: 1(0,0)
Pad_e1321
  round 4 hole 3: 1(0,0)
R0805
  rect 1.133x1.377 smd: 1(-1,0) 2(1,0)
SM8_L3.2-W2.9-P0.65-LS4.3-BR
  oval 1.198x0.315 smd: 1(1.799,-0.975) 2(1.799,-0.325) 3(1.799,0.325) 4(1.799,0.975) 5(-1.799,0.975) 6(-1.799,0.325) 7(-1.799,-0.325) 8(-1.799,-0.975)
SOIC-8_L4.9-W3.9-P1.27-LS6.0-BL
  oval 0.588x2.045 smd: 1(-1.905,-2.772) 2(-0.635,-2.772) 3(0.635,-2.772) 4(1.905,-2.772) 5(1.905,2.772) 6(0.635,2.772) 7(-0.635,2.772) 8(-1.905,2.772)
SOT-23-5_L3.0-W1.7-P0.95-LS2.8-BR
  rect 1.1x0.6 smd: 1(1.3,-0.95) 2(1.3,0) 3(1.3,0.95) 4(-1.3,0.95) 5(-1.3,-0.95)

## Nets
As in the schematic, except:
GND: C1.1 C2.1 C3.1 C4.1 C5.1 C6.1 C8.2 C9.2 C10.2 C11.2 C12.1 C13.2 C14.1 C15.1 C16.1 C17.1 C18.1 C19.1 C20.2 C21.2 C22.1 C23.1 C24.2 C25.2 C27.2 C28.2 C29.1 C30.1 C31.1 C32.1 C33.1 C34.1 C35.1 C36.1 C37.1 C38.1 C39.1 CN5.2 CN6.2 CN7.2 NOREF.1 NOREF#2.1 NOREF#3.1 NOREF#4.1 R6.1 U1.4 U2.15 U3.2 U3.3 U4.4 U5.4 U8.4

Pads without a net: CN3 1; U1 1 3 5 7 8; U2 14 16; U3 4; U5 3 6; U6 8

## Via types
v1: diameter 0.61, hole 0.305, Top Layer to Bottom Layer, 62 vias

## Routing (per net, layer and track width the routed paths; a pad name or vN(x,y) marks a point on that pad's centre or on a via; arc(x,y) is an arc through that point)
3.3V: length 47.7
  Top Layer w0.315: U4.8 78.09,36.36 78.6,36.87 C21.1 ; C25.1 79.32,47.3 78.63,46.61 77.37,46.61
  Top Layer w0.588: C11.1 C10.1 79.28,14.49
  Bottom Layer w0.588: v1(82.22,14.59) 82.22,34.92 v1(78.59,38.55) 78.59,47.87 v1(79.24,48.53)
+2.5V: length 84.6
  Top Layer w0.588: U6.1 27.53,26.87 27.11,27.29 27.11,28.74 27.48,29.11 C27.1 30.82,24.55 32.31,23.06 U6.5 37.12,23.06 C28.1 39.74,23.05 40.23,22.55 U9.5 40.23,16.05 44.9,11.39 C4.2 57.72,11.45 C5.2 57.73,13.78 C6.2 57.74,15.95 C3.2 ; C3.2 57.77,18.14 U1.6 ; C3.2 57.74,20.79 60.34,23.38 v1(60.34,26.9)
  Bottom Layer w0.588: v1(61.84,44.02) 60.34,42.52 60.34,36.84 60.32,36.82 60.32,36.19 60.34,36.17 v1(60.34,26.9)
+5V: length 171.9
  Top Layer w0.315: U4.5 76.34,34.41 75.87,34.87 75.87,35.76 75.28,36.36 73.29,36.36 72.67,36.98 v1(72.67,38.22) ; v1(73.71,48.45) 72.47,48.45 72.07,48.06 72.07,47.01 72.47,46.61 75.19,46.61 75.8,46.01 75.8,44.96 76.09,44.66 U5.5
  Top Layer w0.588: 74.47,14.49 C8.1 72.24,14.46 ; 74.47,14.49 74.47,26.2 v1(70.71,29.97) C22.2 ; 74.47,14.49 U3.1 ; 72.24,14.46 C9.1 72.19,16.86 C1.2 v1(69.56,16.88) C2.2 69.54,16.87 U1.2 ; 72.24,14.46 68.97,14.46 67.01,12.5 C29.2 67.03,10.05 CN5.1 ; R4.2 34.59,46.21 33.48,47.32 U2.10 26.34,47.32 24.98,45.96 C19.2 v1(24.98,41.02) ; R13.2 67.51,30.01 C22.2 ; v1(72.67,38.22) 70.16,38.22 69.8,38.58 67.58,38.58 R14.2 ; C22.2 64.91,29.97 C23.2 64.87,32.65 U8.8 ; 25.06,43.81 27.52,43.81 R5.1
  Bottom Layer w0.588: v1(69.56,16.88) 67.79,16.88 48.65,36.03 29.97,36.03 v1(24.98,41.02) ; v1(73.71,48.45) 74.22,47.94 74.22,39.77 v1(72.67,38.22) 70.71,36.25 v1(70.71,29.97)
+12V: length 72.9
  Top Layer w0.588: C30.2 43.97,10 CN6.1 ; U6.7 34.77,25.6 35.51,26.34 C33.2 ; v1(33.15,29.1) 35.21,29.1 35.43,28.88 ; U7.8 45.35,47.81 C15.2 45.33,45.03 C14.2 v1(45.33,31.72) ; U9.8 44.04,18.7 C37.2 44.08,18.67 C36.2
  Bottom Layer w0.588: v1(44.03,10.01) 44.07,10.05 v1(44.07,16.38) ; v1(33.15,29.1) 33.15,26.02 42.78,16.38 v1(44.07,16.38) ; v1(44.07,16.38) 45.33,17.64 45.33,18.36 45.33,18.36 45.33,18.98 45.33,18.99 v1(45.33,31.72)
-12V: length 79.8
  Top Layer w0.588: U6.4 26.62,23.06 26.06,22.5 C35.2 C34.2 30.22,20.74 32.24,18.71 C31.2 32.25,10.22 CN7.1 ; C17.2 41.52,56.3 C16.2 41.54,53.38 U7.4 ; v1(40.34,43.98) v1(40.34,32.77) 40.34,30.59 C39.2 40.23,30.49 U9.4
  Bottom Layer w0.588: v1(28.4,20.81) 28.4,26.82 34.34,32.77 v1(40.34,32.77) ; v1(39.04,56.31) 40.34,55.02 v1(40.34,43.98)
GND: length 17.3
  Top Layer w0.315: v1(72.57,44.66) 72.58,44.66 U5.4 ; 73.94,34.41 v1(72.67,34.41)
  Top Layer w0.588: U3.3 v1(77.67,12.59) ; v1(61.07,36.5) 61.07,36.51 61.07,38.2 ; v1(30.84,31.09) 33.14,31.09 C32.1 35.48,31.1 C33.1 ; C38.1 42.25,30.53 v1(42.28,30.5) ; U2.15 v1(33.92,53.67) ; 66.15,19.4 v1(68.05,19.4) ; U3.2 v1(77.8,13.54)
  vias: v1(22.87,41.02) v1(22.98,43.81) v1(26.06,18.66) v1(27.42,41.55) v1(28.4,18.63) v1(30.16,10.24) v1(37.13,20.97) v1(38.55,47.89) v1(38.66,45.64) v1(39.06,58.38) v1(41.54,58.37) v1(41.88,10.01) v1(46.08,18.67) v1(46.08,16.37) v1(47.47,45.07) v1(47.44,42.89) v1(55.73,15.94) v1(55.72,13.77) v1(55.94,18.11) v1(57.78,9.31) v1(64.87,27.93) v1(64.94,10.07) v1(67.55,27.89) v1(69.54,18.97) v1(72.16,18.88) v1(72.19,12.36) v1(72.67,40.29) v1(74.45,12.38) v1(75.71,48.4) v1(76.56,38.54) v1(81.4,48.53) v1(82.22,12.41) v1(84.84,12.41)
CUR_3V: length 7.7
  Top Layer w0.315: CN1.1 83.13,36.6 82.24,35.71 U4.7
CUR_5V: length 10.8
  Top Layer w0.315: 73.94,35.71 71,35.71 70.14,36.57 R14.1
  Top Layer w0.588: 64.88,38.2 64.88,37.05 65.36,36.57 R14.1
CUR_N: length 13.7
  Top Layer w0.588: CN4.2 52.27,51.99 47.98,56.29 R1.1 46.01,55.28 45.34,54.61 U7.1
CUR_P: length 34
  Top Layer w0.588: U7.6 42.8,46.28 43.03,46.05 43.84,46.05 44.07,46.28 U7.7 44.07,48.97 44.53,49.43 47.79,49.43 R2.1 54.73,49.42 CN4.1 54.76,43.76 56.84,41.68 R9.1 61.92,40.14 62.34,39.72 62.34,38.2
ERR_3V: length 8.7
  Top Layer w0.315: CN3.2 86.01,45.96 U5.7
ERR_5V: length 52.4
  Top Layer w0.315: v1(71.87,45.96) 73.77,45.96 U5.2
  Top Layer w0.588: v1(29.5,41.55) 29.56,41.61 R5.2 29.56,45.25 30.35,46.05 U2.9
  Bottom Layer w0.315: v1(29.5,41.55) 53.77,41.55 58.17,45.96 v1(71.87,45.96)
VOL_3V: length 7.8
  Top Layer w0.315: U4.6 82.11,35.06 83.11,34.06 CN1.2
VOL_5V: length 12
  Top Layer w0.315: 73.94,35.06 70.92,35.06 70.37,34.5 R13.1
  Top Layer w0.588: R13.1 67.43,34.42 64.29,34.42 63.61,33.74 U8.7
VOL_H: length 12.9
  Top Layer w0.588: R12.1 20.14,22.57 P2.1
VOL_L: length 13
  Top Layer w0.588: R10.2 7.38,27.48 P2.2
VOL_N: length 12.8
  Top Layer w0.588: CN2.2 53.39,24.64 50.01,24.64 48.4,23.03 R7.1 43.22,23.03 42.77,22.58 U9.7
VOL_P: length 26.6
  Top Layer w0.588: 44.04,28.99 R8.1 47.87,28.99 49.58,27.28 CN2.1 55.65,27.28 57.61,29.23 R3.1 60.34,30.47 61.07,31.2 U8.5 ; 44.04,28.99 43.19,28.99 42.77,28.57 U9.2 ; 44.04,28.99 U9.1
$1N2376: length 7.4
  Top Layer w0.588: R10.1 22.28,26.38 22.7,25.97 R11.2 26.03,25.97 26.39,25.6 U6.2
$1N2394: length 7.3
  Top Layer w0.588: R12.2 22.21,23.43 22.75,23.97 R11.1 26.1,23.97 26.47,24.33 U6.3
$1N2836: length 9.6
  Top Layer w0.588: U9.3 41.5,25.63 40.21,24.33 U6.6
$1N2969: length 9.3
  Top Layer w0.588: U9.6 41.5,23.55 42.99,25.03 R7.2 R8.2
$1N3236: length 11.2
  Top Layer w0.588: U2.12 40.46,49.86 41.53,48.79 U7.5
$1N3246: length 8
  Top Layer w0.588: R1.2 44.07,56.23 U7.2 44.07,52.45 45.1,51.42 R2.2
$1N3251: length 12.7
  Top Layer w0.588: U7.3 42.8,52.07 41.86,51.13 U2.13
$1N4341: length 5.8
  Top Layer w0.588: C7.2 R3.2 62.34,29.24 62.34,32.66
$1N4495: length 5.9
  Top Layer w0.588: 63.61,38.2 63.61,39.66 63.92,39.96 R9.2 C26.2
$1N6348: length 9.7
  Top Layer w0.588: U2.11 33.88,48.59 34.58,47.89 C13.1 36.58,47.86 R6.2 36.59,45.64 R4.1

## Copper pours and planes (outline as drawn; the poured copper is in the pictures)
GND on Bottom Layer: -0.56,63.45 90.47,63.45 90.47,-0.33 -0.56,-0.33
CUR_IN on Top Layer: 4.27,56.46 21.91,56.46 21.91,50.76 4.27,50.76
CUR_OUT on Top Layer: 4.29,50.28 21.92,50.28 21.92,45.08 4.29,45.08

## Text on the board
Top Silkscreen Layer: GND | -12V | +5V | N | P | VOL | CUR | ERR | LOW | HIGH | IN | OUT

# Board CKSR15
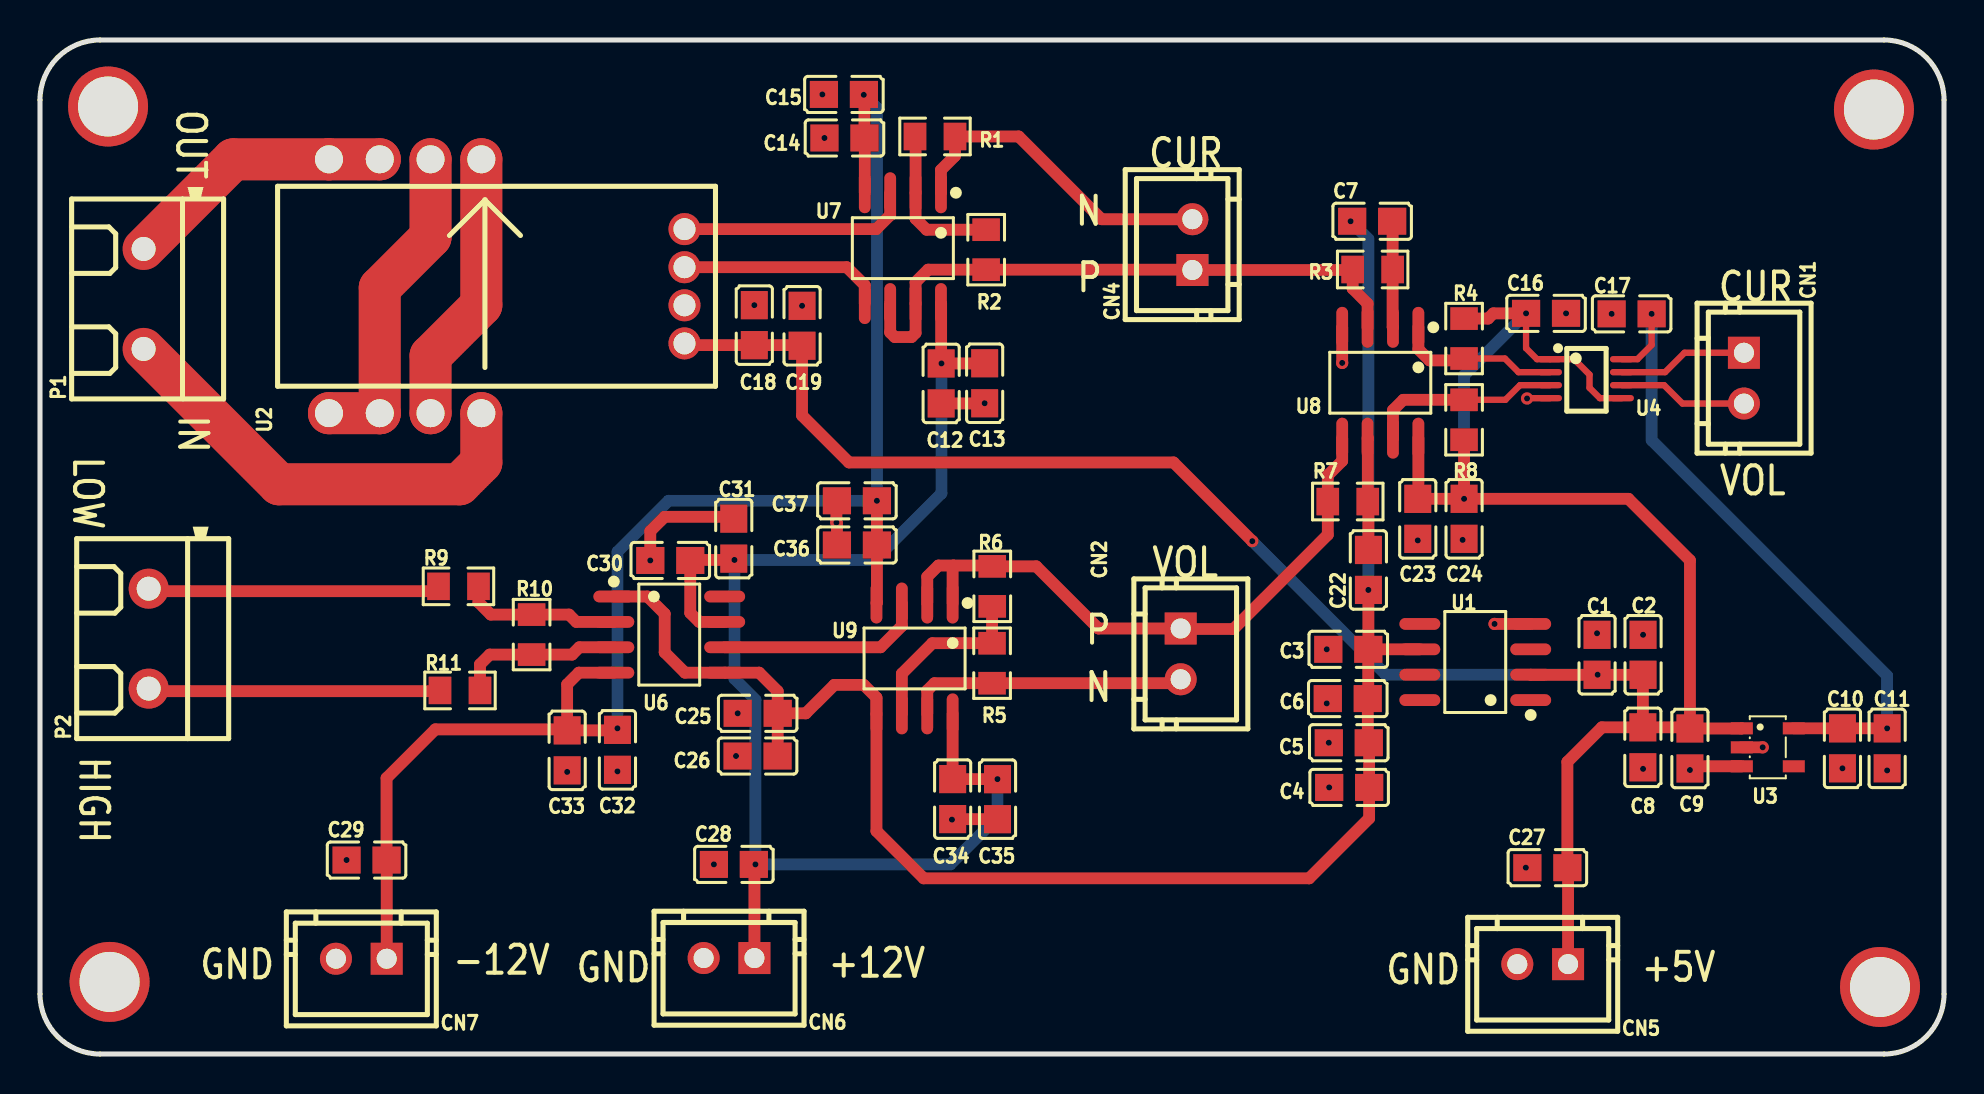
[diagram p4: board, top side]
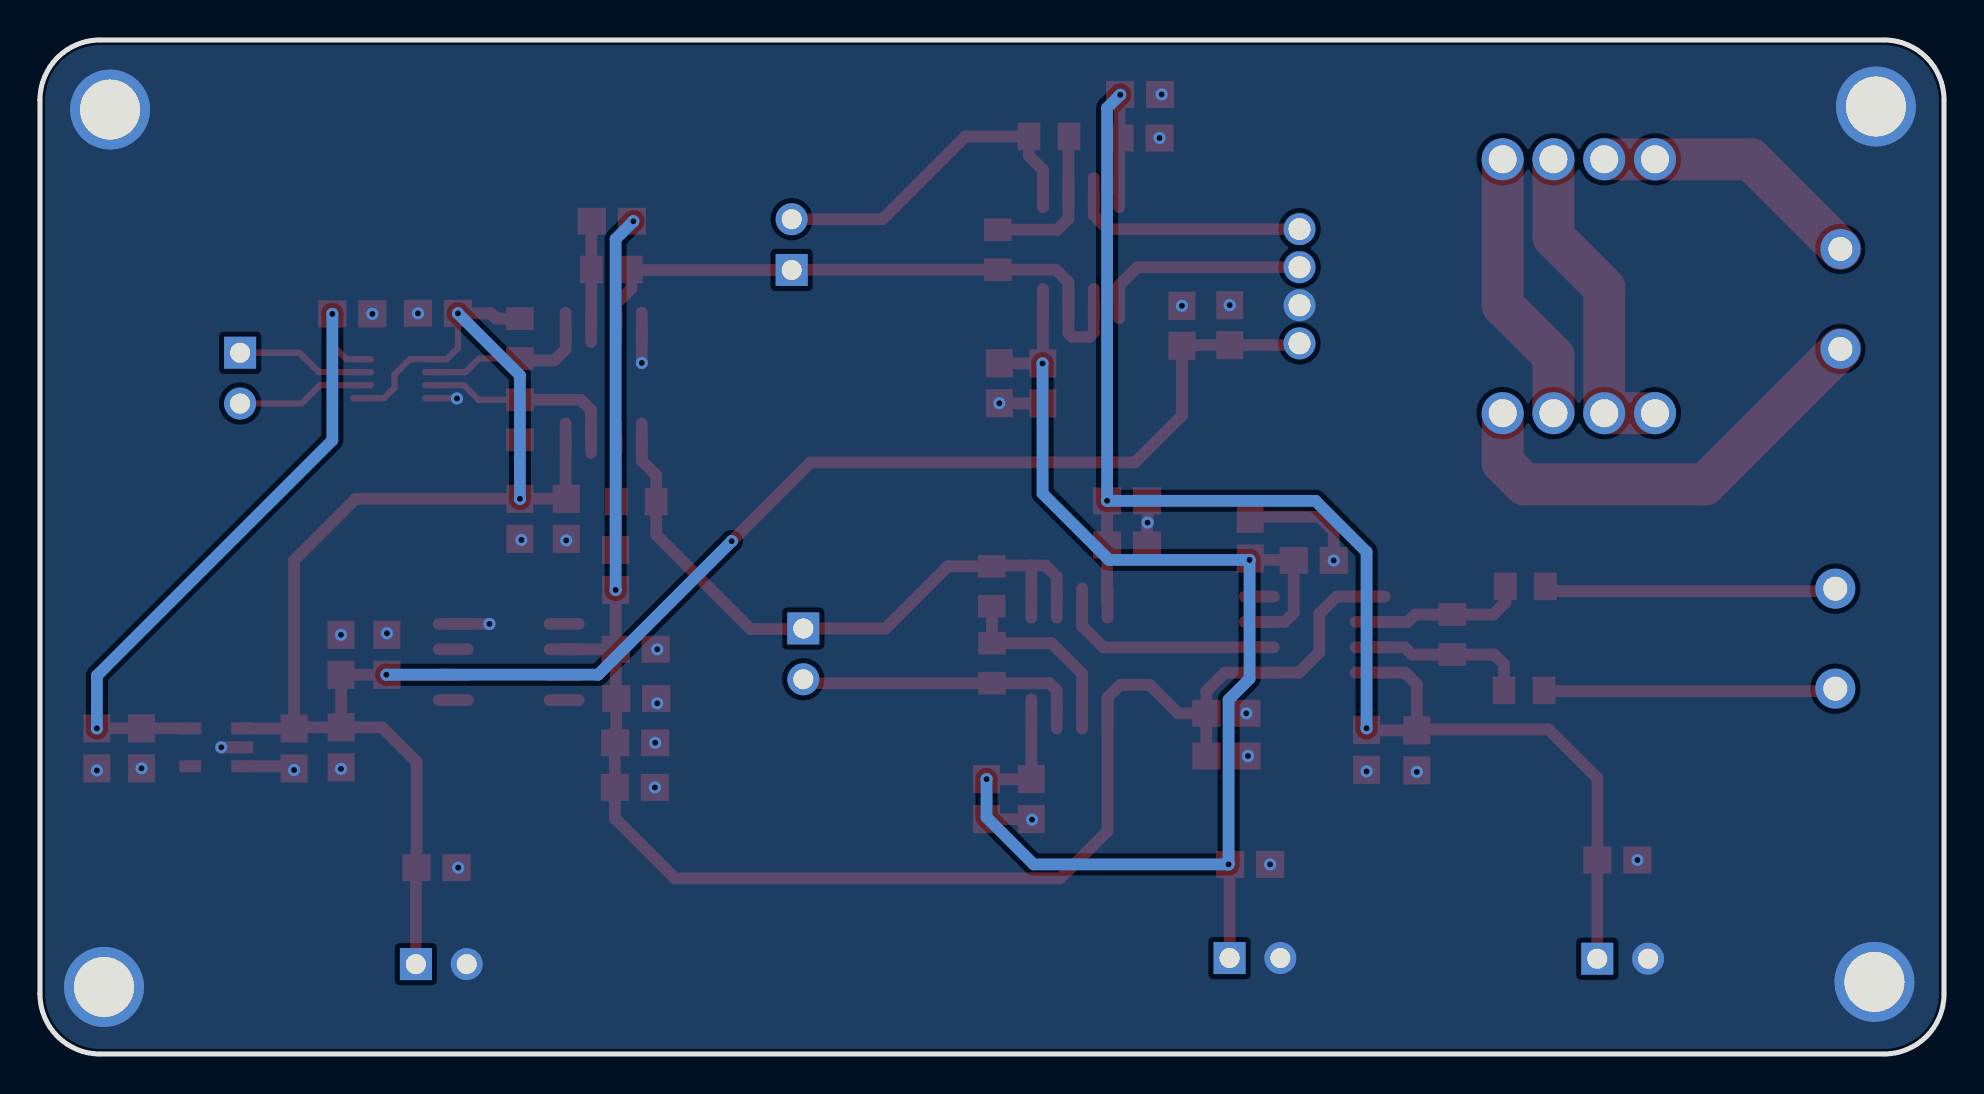
[diagram p5: board, bottom side, seen from below]

Outline 95.22 x 50.72 mm; copper layers: Top Layer, Bottom Layer. Coordinates in mm from the lower left corner of the outline.
Outline path: 0,47.72 0,3 arc(0.88,0.88) 3,0 92.22,0 arc(94.35,0.88) 95.22,3 95.22,47.72 arc(94.35,49.85) 92.22,50.72 3,50.72 arc(0.88,49.85) 0,47.72
Stack: Top Layer 0.035mm / Dielectric1 1.51mm FR4 er 4.5 / Bottom Layer 0.035mm

## Design rules (mm)
template: 自定义配置
spacing copperThickness1oz (default): track to track 0.102, other pairs 0.152 to 0.3
spacing copperThickness2oz: track to track 0.203, other pairs 0.152 to 0.3
track width copperThickness1oz (default): min 0.127, default 0.254, max 2.54
track width copperThickness2oz: min 0.203, default 0.254, max 2.54
differential pair differentialPair (default): width min 0.127, default 0.254, max 2.54; gap min 0.152, default 0.152
via viaSize (default): diameter min 0.5, default 0.61, max 10; hole min 0.3, default 0.305, max 6.3

## Placement (name value [footprint] x y rotation side)
C1  4.7uF  [C0805]  77.87 19.97 270 top
C2  100nF  [C0805]  80.17 19.97 270 top
C3  100nF  [C0805]  65.43 20.24 0 top
C4  4.7uF  [C0805]  65.47 13.34 0 top
C5  4.7uF  [C0805]  65.46 15.57 0 top
C6  4.7uF  [C0805]  65.41 17.78 0 top
C7  100nF  [C0805]  66.62 41.66 0 top
C8  1uF  [C0805]  80.16 15.34 270 top
C9  100nF  [C0805]  82.52 15.28 270 top
C10  1uF  [C0805]  90.14 15.29 270 top
C11  100nF  [C0805]  92.38 15.29 270 top
C12  100nF  [C0805]  45.07 33.54 90 top
C13  1uF  [C0805]  47.24 33.55 90 top
C14  100nF  [C0805]  40.23 45.82 0 top
C15  1uF  [C0805]  40.21 48 0 top
C16  100nF  [C0805]  75.32 37.05 0 top
C17  100nF  [C0805]  79.6 37.02 180 top
C18  100nF  [C0805]  35.72 36.46 270 top
C19  1uF  [C0805]  38.11 36.43 270 top
C22  100nF  [C0805]  66.44 24.21 90 top
C23  100nF  [C0805]  68.91 26.77 90 top
C24  1uF  [C0805]  71.22 26.77 90 top
C25  1uF  [C0805]  35.89 17.04 180 top
C26  1uF  [C0805]  35.89 14.91 180 top
C27  10uF  [C0805]  75.39 9.32 0 top
C28  10uF  [C0805]  34.7 9.49 0 top
C29  10uF  [C0805]  16.33 9.7 0 top
C30  100nF  [C0805]  31.52 24.69 0 top
C31  1uF  [C0805]  34.7 25.78 270 top
C32  100nF  [C0805]  28.88 15.22 90 top
C33  1uF  [C0805]  26.37 15.19 90 top
C34  100nF  [C0805]  45.64 12.75 90 top
C35  1uF  [C0805]  47.89 12.75 90 top
C36  100nF  [C0805]  40.86 25.46 0 top
C37  1uF  [C0805]  40.86 27.67 0 top
CN1  CON2-2.54*2P  [CONN-TH_2P-P2.54-V]  85.22 33.81 270 top
CN2  CON2-2.54*2P  [CONN-TH_2P-P2.54-V]  57.05 20.02 270 top
CN4  CON2-2.54*2P  [CONN-TH_2P-P2.54-V]  57.63 40.49 90 top
CN5  CON2-2.54*2P  [CONN-TH_2P-P2.54-V]  75.15 4.5 180 top
CN6  CON2-2.54*2P  [CONN-TH_2P-P2.54-V]  34.46 4.8 180 top
CN7  CON2-2.54*2P  [CONN-TH_2P-P2.54-V]  16.07 4.77 180 top
NOREF  -  [Pad_e785]  3.48 3.61 0 top
NOREF#2  -  [Pad_e783]  3.4 47.4 0 top
NOREF#3  -  [Pad_e786]  92.02 3.35 0 top
NOREF#4  -  [Pad_e787]  91.72 47.24 0 top
P1  KF301-2P接线端子  [CONN-TH_XY301V-A-5.0-2P]  5.18 37.77 90 top
P2  KF301-2P接线端子  [CONN-TH_XY301V-A-5.0-2P]  5.44 20.78 90 top
R1  10K  [R0805]  44.76 45.9 180 top
R2  10K  [R0805]  47.32 40.23 90 top
R3  10K  [R0805]  66.65 39.24 0 top
R4  10K  [R0805]  71.22 35.79 90 top
R5  10K  [R0805]  47.62 19.55 90 top
R6  10K  [R0805]  47.62 23.39 270 top
R7  10K  [R0805]  65.41 27.64 0 top
R8  10K  [R0805]  71.22 31.72 270 top
R9  10K  [R0805]  20.93 23.39 180 top
R10  10K  [R0805]  24.59 20.98 90 top
R11  10K  [R0805]  21.01 18.19 0 top
U1  REF5025AIDR  [SOIC-8_L4.9-W3.9-P1.27-LS6.0-BL]  71.78 19.61 90 top
U2  CKSR6-NP  [SENSOR-TH_CKSR6-NP]  23.34 38.41 90 top
U3  TLV75533PDBVR  [SOT-23-5_L3.0-W1.7-P0.95-LS2.8-BR]  86.41 15.34 180 top
U4  SN74LVC2T45DCTR  [SM8_L3.2-W2.9-P0.65-LS4.3-BR]  77.32 33.78 180 top
U6  INA149AID  [SOIC-8_L4.9-W3.9-P1.27-LS6.0-BL]  31.47 20.98 270 top
U7  OPA2192IDR  [SOIC-8_L4.9-W3.9-P1.27-LS6.0-BL]  43.15 40.31 180 top
U8  TLV3202AIDR  [SOIC-8_L4.9-W3.9-P1.27-LS6.0-BL]  67.03 33.58 180 top
U9  OPA2192IDR  [SOIC-8_L4.9-W3.9-P1.27-LS6.0-BL]  43.74 19.79 180 top

## Footprints (pads in the part's own frame, mm; a bottom-side part is the same pattern mirrored in y, then rotated)
C0805
  rect 1.41x1.35 smd: 1(-1,0) 2(1,0)
CONN-TH_2P-P2.54-V
  rect 1.6x1.6 hole 1: 1(-1.27,0)
  round 1.6 hole 1: 2(1.27,0)
CONN-TH_XY301V-A-5.0-2P
  round 2 hole 1.2: 1(-2.5,0) 2(2.5,0)
Pad_e783
  round 4 hole 3: 1(0,0)
Pad_e785
  round 4 hole 3: 1(0,0)
Pad_e786
  round 4 hole 3: 1(0,0)
Pad_e787
  round 4 hole 3: 1(0,0)
R0805
  rect 1.133x1.377 smd: 1(-1,0) 2(1,0)
SENSOR-TH_CKSR6-NP
  round 2.1 hole 1.4: 2(-6.35,1.27) 3(-6.35,3.81) 4(-6.35,6.35) 5(-6.35,8.89) 6(6.35,8.89) 7(6.35,6.35) 8(6.35,3.81) 9(6.35,1.27)
  round 1.6 hole 1.1: 11(2.858,-8.89) 12(0.953,-8.89) 13(-0.953,-8.89) 14(-2.858,-8.89)
SM8_L3.2-W2.9-P0.65-LS4.3-BR
  oval 1.198x0.315 smd: 1(1.799,-0.975) 2(1.799,-0.325) 3(1.799,0.325) 4(1.799,0.975) 5(-1.799,0.975) 6(-1.799,0.325) 7(-1.799,-0.325) 8(-1.799,-0.975)
SOIC-8_L4.9-W3.9-P1.27-LS6.0-BL
  oval 0.588x2.045 smd: 1(-1.905,-2.772) 2(-0.635,-2.772) 3(0.635,-2.772) 4(1.905,-2.772) 5(1.905,2.772) 6(0.635,2.772) 7(-0.635,2.772) 8(-1.905,2.772)
SOT-23-5_L3.0-W1.7-P0.95-LS2.8-BR
  rect 1.1x0.6 smd: 1(1.3,-0.95) 2(1.3,0) 3(1.3,0.95) 4(-1.3,0.95) 5(-1.3,-0.95)

## Nets
As in the schematic, except:
GND: C1.1 C2.1 C3.1 C4.1 C5.1 C6.1 C8.2 C9.2 C10.2 C11.2 C12.1 C13.1 C14.1 C15.1 C16.2 C17.2 C18.1 C19.1 C23.1 C24.1 C25.2 C26.2 C27.1 C28.1 C29.1 C30.1 C31.1 C32.1 C33.1 C34.1 C35.1 C36.1 C37.1 CN5.2 CN6.2 CN7.2 NOREF.1 NOREF#2.1 NOREF#3.1 NOREF#4.1 U1.4 U2.13 U3.2 U3.3 U4.4 U8.4

Pads without a net: U1 1 3 5 7 8; U3 4; U6 8

## Via types
v1: diameter 0.61, hole 0.305, Top Layer to Bottom Layer, 48 vias

## Routing (per net, layer and track width the routed paths; a pad name or vN(x,y) marks a point on that pad's centre or on a via; arc(x,y) is an arc through that point)
3.3V: length 33.6
  Top Layer w0.315: U4.8 79.89,34.76 80.6,35.47 v1(80.6,37.02)
  Top Layer w0.588: U3.5 90.14,16.29 ; C10.1 v1(92.38,16.29)
  Bottom Layer w0.588: v1(92.38,16.29) 92.38,18.92 80.6,30.7 v1(80.6,37.02)
+2.5V: length 86.7
  Top Layer w0.588: C3.2 66.43,17.81 C6.2 66.41,15.62 C5.2 66.47,15.55 C4.2 66.47,11.79 63.47,8.79 44.2,8.79 41.83,11.15 U9.5 41.83,17.83 41.2,18.47 39.73,18.47 38.3,17.04 C25.1 ; C3.2 U1.6 ; C3.2 66.44,20.25 v1(66.44,23.21) ; C25.1 36.89,18.15 35.97,19.08 U6.5 32.26,19.08 31.24,20.09 31.24,22.02 30.38,22.89 U6.1 ; C25.1 36.89,14.91 C26.1
  Bottom Layer w0.588: v1(66.44,23.21) 66.44,40.77 v1(65.55,41.66)
+5V: length 133.4
  Top Layer w0.315: U4.5 78.01,32.81 77.5,33.33 77.5,33.99 76.72,34.76 U4.1 74.87,34.76 74.32,35.31 v1(74.32,37.05)
  Top Layer w0.588: v1(71.22,27.77) 68.96,27.77 68.94,27.8 ; v1(71.22,27.77) R8.2 ; v1(71.22,27.77) 79.44,27.77 82.52,24.7 C9.1 ; C9.1 82.46,16.34 C8.1 ; C9.1 85.1,16.28 U3.1 ; C8.1 78.11,16.34 76.39,14.61 C27.2 76.42,9.29 CN5.1 ; C8.1 80.16,18.96 C2.2 C1.2 74.56,18.97 U1.2 ; 68.94,27.8 C23.2 ; 68.94,27.8 U8.8 ; R4.2 72.42,36.79 72.69,37.05 v1(74.32,37.05) ; v1(60.63,25.65) 56.69,29.59 40.46,29.59 38.11,31.94 38.11,35.43 38.08,35.46 C18.2 32.32,35.46 32.23,35.55
  Bottom Layer w0.588: v1(60.63,25.65) 67.31,18.97 v1(77.9,18.97) ; v1(71.22,27.77) 71.22,33.95 v1(74.32,37.05)
+12V: length 71
  Top Layer w0.588: C28.2 35.73,9.46 CN6.1 ; C35.2 v1(47.88,13.75) C34.2 U9.8 ; C13.2 47.23,34.54 C12.2 45.07,37.53 U7.8 ; U6.7 32.97,21.62 32.52,22.06 C30.2 32.55,24.71 v1(34.73,24.71)
  Bottom Layer w0.588: v1(47.88,13.75) 47.88,11.84 45.53,9.49 v1(35.78,9.49) 35.78,17.72 34.73,18.77 v1(34.73,24.71) 41.76,24.71 45.09,28.04 v1(45.09,34.54)
-12V: length 80
  Top Layer w0.588: v1(41.2,47.98) 41.23,47.95 C14.2 41.25,45.81 U7.4 ; U6.4 26.95,19.08 26.37,18.49 C33.2 ; C33.2 26.31,16.24 19.77,16.24 17.33,13.8 C29.2 17.34,9.69 CN7.1 ; C33.2 28.85,16.19 C32.2 ; U9.4 41.86,22.58 C36.2 v1(41.86,27.67)
  Bottom Layer w0.588: v1(28.88,16.29) 28.88,25.12 31.43,27.67 v1(41.86,27.67) 41.86,47.32 v1(41.2,47.98)
GND: length 21.1
  Top Layer w0.315: v1(74.37,32.79) 74.39,32.81 U4.4
  Top Layer w0.588: C35.1 45.65,11.75 C34.1 ; C12.1 47.23,32.54 v1(47.24,32.55) ; U3.3 82.63,14.39 C9.2 ; v1(30.52,24.69) 30.52,26.15 31.24,26.87 34.6,26.87 C31.1 ; U3.2 v1(86.16,15.34) ; C37.1 39.83,27.65 v1(39.83,26.58) 39.86,26.56 C36.1 ; U8.4 v1(65.13,34.57) ; U1.4 v1(72.75,21.51)
  vias: v1(15.33,9.7) v1(26.37,14.11) v1(28.88,14.14) v1(33.7,9.49) v1(34.81,14.91) v1(34.89,17.04) v1(35.72,37.46) v1(38.11,37.43) v1(39.13,48) v1(39.23,45.82) v1(45.61,11.72) v1(64.35,20.24) v1(64.35,17.54) v1(64.46,15.57) v1(64.47,13.34) v1(68.91,25.69) v1(71.15,25.72) v1(74.31,9.32) v1(76.32,37.05) v1(77.87,21.05) v1(78.6,37.02) v1(80.17,20.97) v1(80.17,14.26) v1(82.52,14.21) v1(90.14,14.29) v1(92.38,14.19)
CUR_3V: length 6.5
  Top Layer w0.315: U4.7 81.28,34.11 82.25,35.08 CN1.1
CUR_5V: length 8.2
  Top Layer w0.315: U4.2 73.94,34.11 73.26,34.79 R4.1
  Top Layer w0.588: U8.1 68.94,35.26 69.49,34.7 71.13,34.7 R4.1
CUR_IN: length 22.6
  Top Layer w2.1: U2.2 22.07,29.59 20.98,28.5 11.95,28.5 P1.1
CUR_N: length 16.7
  Top Layer w0.588: U7.1 45.06,44.22 45.76,44.92 R1.1 48.95,45.9 53.09,41.76 CN4.2
CUR_OUT: length 13.7
  Top Layer w2.1: U2.7 U2.6 9.67,44.75 P1.2
CUR_P: length 30.8
  Top Layer w0.588: U7.6 42.52,36.09 42.75,35.86 43.59,35.86 43.79,36.07 U7.7 43.79,38.61 44.42,39.23 R2.1 57.62,39.23 CN4.1 65.62,39.22 R3.1 65.65,38.29 66.4,37.54 U8.3
VOL_3V: length 6.5
  Top Layer w0.315: CN1.2 82.14,32.54 81.22,33.46 U4.6
VOL_5V: length 9.8
  Top Layer w0.315: U4.3 74.02,33.46 73.29,32.72 R8.1
  Top Layer w0.588: R8.1 68.18,32.72 67.67,32.21 U8.7
VOL_H: length 14.6
  Top Layer w0.588: P2.1 5.56,18.15 19.97,18.15 R11.1
VOL_L: length 14.6
  Top Layer w0.588: P2.2 5.56,23.15 19.69,23.15 R9.2
VOL_N: length 14.1
  Top Layer w0.588: CN2.2 56.85,18.55 R5.1 44.74,18.55 44.37,18.19 U9.7
VOL_P: length 31.9
  Top Layer w0.588: U9.1 45.64,24.4 45.68,24.44 ; U9.2 44.37,23.88 44.93,24.44 45.68,24.44 ; 45.68,24.44 47.58,24.44 R6.1 49.83,24.39 52.93,21.29 CN2.1 57.07,21.26 59.69,21.26 64.41,25.97 R7.1 64.41,28.95 65.13,29.67 U8.5
$1N3362: length 8
  Top Layer w0.588: U6.2 26.82,21.62 26.46,21.98 R10.2 22.55,21.98 21.93,22.6 R9.1
$1N3363: length 8.4
  Top Layer w0.588: R11.2 22.01,19.49 22.5,19.98 R10.1 26.61,19.98 26.97,20.35 U6.3
$1N3370: length 10.4
  Top Layer w0.588: U6.6 42.04,20.35 43.1,21.41 U9.3
$1N3373: length 9
  Top Layer w0.588: U9.6 43.1,19.03 44.63,20.55 R5.2 47.62,22.38 R6.2
$1N3378: length 10.3
  Top Layer w0.588: 32.23,39.36 40.35,39.36 41.25,38.46 U7.5
$1N3381: length 7.9
  Top Layer w0.588: R2.2 44.34,41.23 43.79,41.78 U7.2 43.79,45.87 R1.2
$1N3382: length 11.7
  Top Layer w0.588: U7.3 42.52,41.96 41.82,41.26 32.23,41.26
$1N3389: length 5.6
  Top Layer w0.588: U8.6 66.41,30.8 R7.2 66.44,27.61 C22.2
$1N3392: length 5.3
  Top Layer w0.588: U8.2 67.65,36.37 R3.2 67.65,41.63 C7.2
$1N3695: length 13.8
  Top Layer w2.1: U2.9 22.07,37.47 19.53,34.92 19.53,32.06
$1N3709: length 16.3
  Top Layer w2.1: 19.53,44.75 19.53,40.87 16.99,38.33 U2.4 U2.5

## Copper pours and planes (outline as drawn; the poured copper is in the pictures)
GND on Bottom Layer: -0.36,51.05 95.53,51.05 95.53,-0.36 -0.36,-0.36

## Text on the board
Top Silkscreen Layer: GND | -12V | +12V | N | P | CUR | VOL | +5V | LOW | HIGH | OUT | IN
